# EasyEDA Pro project ReuseBlock_遥控器1.0_2026-08-15.epro

# Schematic 遥控器1.0
Board Name: 简易版; Create Date: 2025-06-16; Page Name: P1; Project Name: 遥控器; Schematic Name: Schematic1; Update Date: 2025-09-30; Company: 逸行陈Ezwalk; Page Size: A4; Version: V1.0
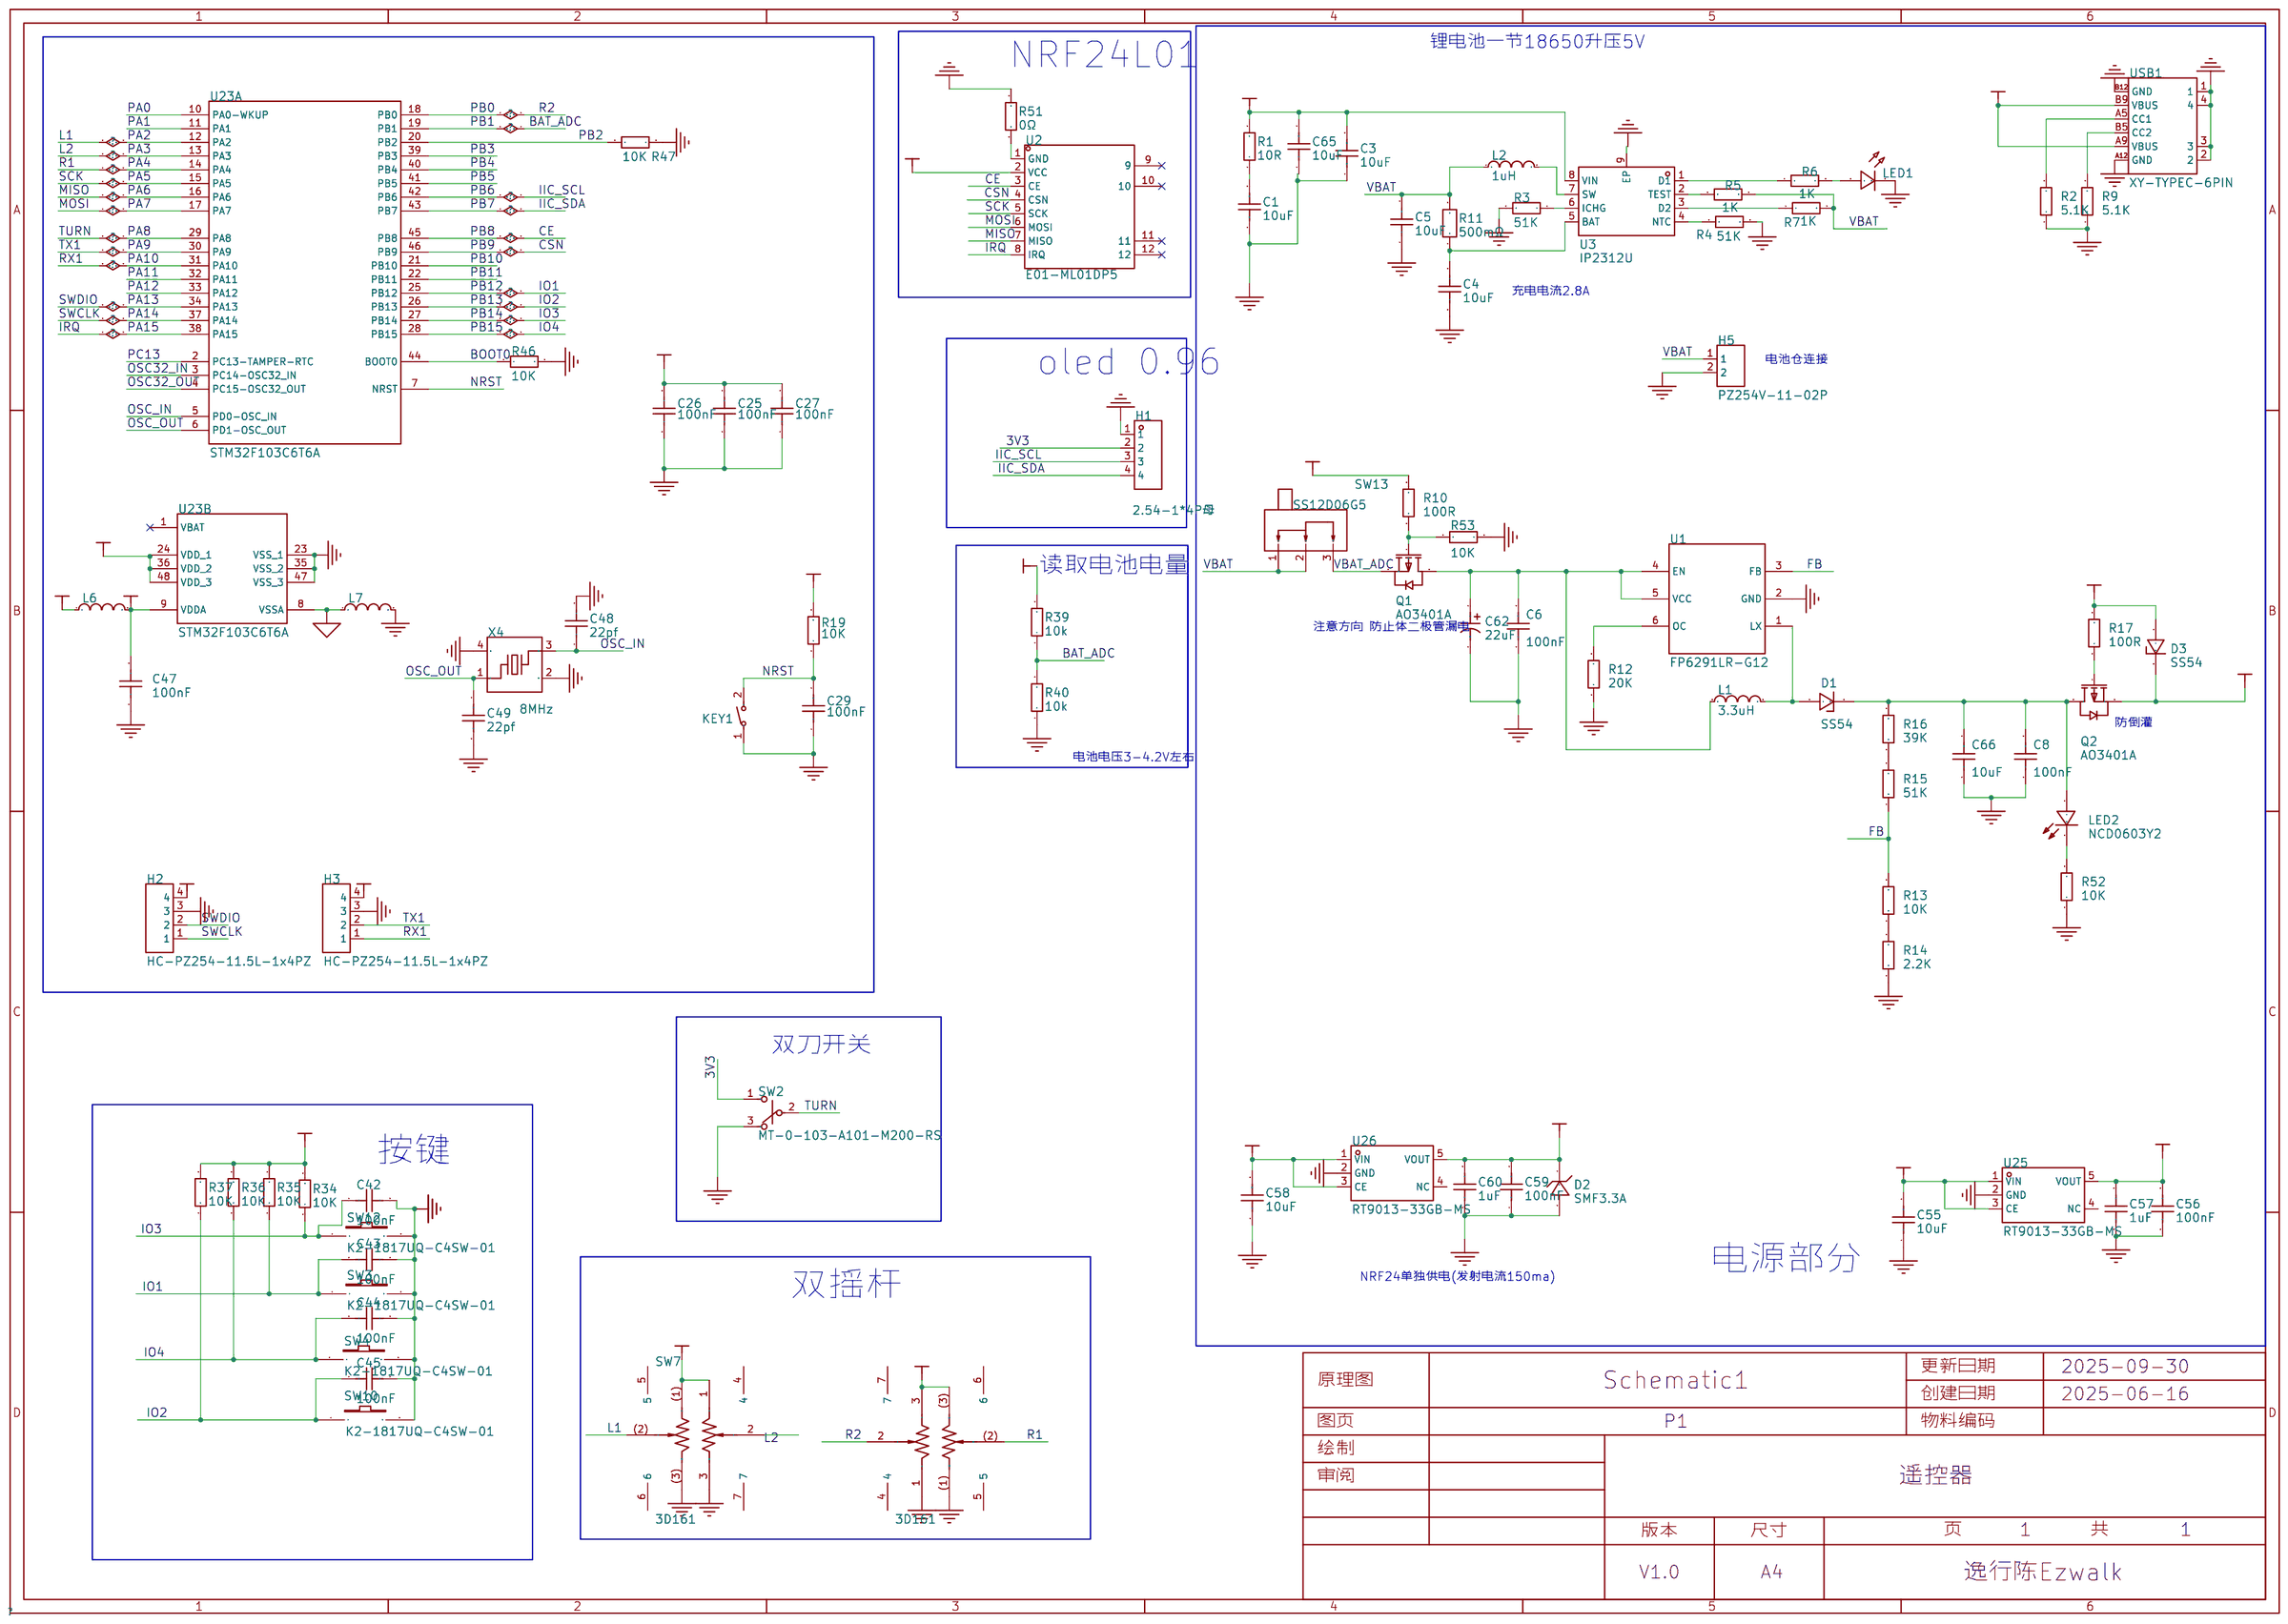
[diagram p0: schematic sheet]

## Parts
C1  10uF  [C0603]
C3  10uF  [C0603]
C4  10uF  [C0603]
C5  10uF  [C0603]
C6  100nF  [C0603]
C8  100nF  [C0603]
C25  100nF  [C0603]
C26  100nF  [C0603]
C27  100nF  [C0603]
C29  100nF  [C0603]
C42  100nF  [C0603]
C43  100nF  [C0603]
C44  100nF  [C0603]
C45  100nF  [C0603]
C47  100nF  [C0603]
C48  22pf  [C0603]
C49  22pf  [C0603]
C55  10uF  [C0603]
C56  100nF  [C0603]
C57  1uF  [C0603]
C58  10uF  [C0603]
C59  100nF  [C0603]
C60  1uF  [C0603]
C62  22uF  [CAP-SMD_BD5.0-L5.3-W5.3-LS6.3-FD-1]
C65  10uF  [C0603]
C66  10uF  [C0603]
D1  SS54  [SMA_L4.3-W2.6-LS5.0-FD]
D2  SMF3.3A  [SOD-123_L2.8-W1.8-LS3.7-RD]
D3  SS54  [SMA_L4.3-W2.6-LS5.0-FD]
H1  2.54-1*4P母  [HDR-TH_4P-P2.54-V-F]
H2  HC-PZ254-11.5L-1x4PZ  [HDR-TH_4P-P2.54-V-M]
H3  HC-PZ254-11.5L-1x4PZ  [HDR-TH_4P-P2.54-V-M]
H5  PZ254V-11-02P  [HDR-TH_2P-P2.54-V-M]
KEY1  YTS1C0051AWG00  [SW-SMD_L6.1-W3.6-LS8.0]
L1  3.3uH  [IND-SMD_L4.4-W4.2-A]
L2  1uH  [IND-SMD_L4.4-W4.2]
L6  10uH  [L0603]
L7  10uH  [L0603]
LED1  -  [LED_0603]
LED2  NCD0603Y2  [LED0603-RD]
Q1  AO3401A  [SOT-23_L2.9-W1.3-P1.90-LS2.4-BR]
Q2  AO3401A  [SOT-23_L2.9-W1.3-P1.90-LS2.4-BR]
R1  10R  [R0603]
R2  5.1K  [R0603]
R3  51K  [R0603]
R4  51K  [R0603]
R5  1K  [R0603]
R6  1K  [R0603]
R7  1K  [R0603]
R9  5.1K  [R0603]
R10  100R  [R0603]
R11  500mΩ  [R0805]
R12  20K  [R0603]
R13  10K  [R0603]
R14  2.2K  [R0603]
R15  51K  [R0603]
R16  39K  [R0603]
R17  100R  [R0603]
R19  10K  [R0603]
R34  10K  [R0603]
R35  10K  [R0603]
R36  10K  [R0603]
R37  10K  [R0603]
R39  10k  [R0603]
R40  10k  [R0603]
R46  10K  [R0603]
R47  10K  [R0603]
R51  0Ω  [R0805]
R52  10K  [R0603]
R53  10K  [R0603]
SW2  MT-0-103-A101-M200-RS  [SW-TH_MT-0-103-A101-M200-RS]
SW3  K2-1817UQ-C4SW-01  [KEY-SMD_2P-L6.0-W6.0-P6.00]
SW4  K2-1817UQ-C4SW-01  [KEY-SMD_2P-L6.0-W6.0-P6.00]
SW6  3D161  [SW-TH_3D161]
SW7  3D161  [SW-TH_3D161]
SW10  K2-1817UQ-C4SW-01  [KEY-SMD_2P-L6.0-W6.0-P6.00]
SW12  K2-1817UQ-C4SW-01  [KEY-SMD_2P-L6.0-W6.0-P6.00]
SW13  SS12D06G5  [SW-TH_SS12D06G5]
U1  FP6291LR-G12  [SOT-23-6_L2.9-W1.6-P0.95-LS2.8-BR]
U2  E01-ML01DP5  [WIRELM-TH_E01-ML01DP5]
U3  IP2312U  [ESOP-8_L4.9-W3.9-P1.27-LS6.0-BL-EP]
U23  STM32F103C6T6A  [LQFP-48_L7.0-W7.0-P0.50-LS9.0-BL]  (sections 1,2)
U25  RT9013-33GB-MS  [SOT-23-5_L2.9-W1.6-P0.95-LS2.8-BR]
U26  RT9013-33GB-MS  [SOT-23-5_L2.9-W1.6-P0.95-LS2.8-BR]
USB1  XY-TYPEC-6PIN  [USB-C-SMD_XY-TYPEC-6PIN]
X4  8MHz  [CRYSTAL-SMD_4P-L3.2-W2.5-BL-1]

## Library data of the parts
C1 C3-C6 C8 C25-C27 C29 C42-C45 C47-C49 C55-C60 C65 C66 = CAP_0603: Supplier Footprint: 0603
C62 = RVT25V22M5X5: 容值:22uF;精度:±20%;额定电压:25V;纹波电流:26mA@120Hz;; LCSC Part Name: 22uF ±20% 25V; Supplier Part: C47023110; Manufacturer: JIERR(捷而瑞); Supplier Footprint: SMD,D5xL5.4mm; JLCPCB Part Class: Extended Part; Datasheet: https://item.szlcsc.com/datasheet/RVT25V22M5X5/49206211.html; Supplier: LCSC; Tolerance: ±20%; Voltage Rating: 25V; Ripple Current: 26mA@120Hz; Diameter: 5mm; Height - Seated (Max): 5.4mm; Lifetime: 2000hrs@105℃; Operating Temperature: -55℃~+105℃
D1 D3 = SS54_C7420369: 二极管配置:独立式;正向压降(Vf):550mV@5.0A;直流反向耐压(Vr):40V;整流电流:5A;; LCSC Part Name: 电压:40V 电流:5A; Supplier Part: C7420369; Manufacturer: R+O(宏嘉诚); Supplier Footprint: SMA(DO-214AC); JLCPCB Part Class: Extended Part; Datasheet: https://item.szlcsc.com/datasheet/SS54/8397191.html; Supplier: LCSC; Diode Configuration: 独立式; Forward Voltage (Vf@If): 550mV@5.0A; Reverse Voltage (Vr): 40V; Rectified Current: 5A; Reverse Leakage Current (Ir): 50uA@40V; Voltage - Forward(Vf@If): 550mV@5.0A; Voltage - DC Reverse(Vr): 40V; Current - Rectified: 5A; Operating Junction Temperature Range: -55℃~+125℃; Non-Repetitive Peak Forward Surge Current: 120A
D2 = SMF3.3A_C283866: 极性:单向;反向截止电压(Vrwm):3.3V;钳位电压:8V;峰值脉冲电流(Ipp):25A;峰值脉冲功率(Ppp):200W@10/1000us;击穿电压:5.2V;; LCSC Part Name: 单向TVS 3.3V截止 峰值浪涌电流：25A; Supplier Part: C283866; Manufacturer: DOWO(东沃); Supplier Footprint: SOD-123FL; JLCPCB Part Class: 扩展库; Datasheet: https://item.szlcsc.com/datasheet/SMF3.3A/269417.html; Supplier: LCSC; Polarity: 单向; Reverse Stand-Off Voltage (Vrwm): 3.3V; Clamping Voltage: 8V; Peak Pulse Current (Ipp): 25A; Peak Pulse Power Dissipation (Ppp): 200W@10/1000us; Voltage - Breakdown: 5.2V; Reverse Leakage Current (Ir): 500uA; level of protection: IEC 61000-4-2；IEC 61000-4-4; Type: TVS
H1 = 2.54-1*4P母: 插孔结构:1x4P;间距:2.54mm;行距:-;圆孔/方孔:方孔;安装类型:直插;排数:单排;总孔位数:4P;额定电流:3A;额定电压:-;插孔方向:顶部;塑高:-;触头材质:青铜;触头镀层:-;工作温度范围:-40℃~+105℃;焊接温度(最大值):-;; LCSC Part Name: 间距:2.54mm 1x4P 直插; Supplier Part: C2718488; Manufacturer: BOOMELE(博穆精密); Supplier Footprint: 插件,P=2.54mm; JLCPCB Part Class: 扩展库; Datasheet: https://atta.szlcsc.com/upload/public/pdf/source/20210301/C2718488_F4427B881E42CAA8DDB0B1C12B3A522C.pdf; Supplier: LCSC; Holes Structure: 1x4P; Pitch: 2.54mm; Circular Hole / Square Hole: 方孔; Mounting Type: 直插; Number of Rows: 单排; Number of Holes: 4P; Current Rating (Max): 3A; Holes Direction: 顶部; Contact Material: 青铜; Operating Temperature Range: -40℃~+105℃
H2 H3 = HC-PZ254-11.5L-1x4PZ: 插针结构:1x4P;间距:2.54mm;行距:-;圆针/方针:方针;安装方式:直插;排数:单排;总PIN位数:4P;额定电流:3A;额定电压:-;配合针长度:6mm;塑高:2.5mm;端接针长度:3mm;触头材质:黄铜;触头镀层:金;工作温度:-40℃~+105℃;颜色:黑色;; LCSC Part Name: 1x4P 间距:2.54mm 方针 直插; Supplier Part: C27985189; Manufacturer: HC(虹成电子); Supplier Footprint: 插件,P=2.54mm; JLCPCB Part Class: 扩展库; Datasheet: https://item.szlcsc.com/datasheet/HC-PZ254-11.5L-1x4PZ/29721147.html; Supplier: LCSC; Pin Structure: 1x4P; Pitch: 2.54mm; Circluar Pins/Square Pins: 方针; Mounting Type: 直插; Number of Rows: 单排; Number of Pins: 4P; Current Rating: 3A; Length of Mating Pin: 6mm; Insulation Height: 2.5mm; Length of End Connection Pin: 3mm; Contact Material: 黄铜; Contact Plating: 金; Operating Temperature: -40℃~+105℃; Color: 黑色
H5 = PZ254V-11-02P: 插针结构:1x2P;间距:2.54mm;行距:-;圆针/方针:方针;安装方式:直插;排数:单排;总PIN位数:2P;额定电流:-;额定电压:-;配合针长度:6mm;塑高:2.5mm;端接针长度:3mm;触头材质:黄铜;触头镀层:-;工作温度:-40℃~+105℃;颜色:黑色;; LCSC Part Name: 1x2P 间距:2.54mm 方针 直插; Supplier Part: C492401; Manufacturer: XFCN(兴飞); Supplier Footprint: 插件,P=2.54mm; JLCPCB Part Class: Extended Part; Datasheet: https://item.szlcsc.com/datasheet/PZ254V-11-02P/502957.html; Supplier: LCSC; Pin Structure: 1x2P; Pitch: 2.54mm; Circluar Pins/Square Pins: 方针; Mounting Type: 直插; Number of Rows: 单排; Number of Pins: 2P; Length of Mating Pin: 6mm; Insulation Height: 2.5mm; Length of End Connection Pin: 3mm; Contact Material: 黄铜; Operating Temperature: -40℃~+105℃; Color: 黑色
KEY1 = YTS1C0051AWG00: 开关长度:6.1mm;开关宽度:3.6mm;开关高度:2.5mm;机械寿命:-;; LCSC Part Name: 白色按键头3.6x6.1x2.5 180gf两脚贴片; Supplier Part: C5159017; Manufacturer: YIYUAN(怡远); Supplier Footprint: SMD; JLCPCB Part Class: 扩展库; Datasheet: https://atta.szlcsc.com/upload/public/pdf/source/20220909/90D1F3506E0247DF6BB595157A95988A.pdf; Supplier: LCSC; Switch Length: 6.1mm; Switch Width: 3.6mm; Switch Height: 2.5mm
L1 = FXL0420-3R3-M: 电感值:3.3uH;精度:±20%;额定电流:3.3A;饱和电流(Isat):4A;类型:一体成型电感;; LCSC Part Name: 3.3uH ±20% 4A; Supplier Part: C167207; Manufacturer: cjiang(长江微电); Supplier Footprint: SMD,4.4x4.2mm; JLCPCB Part Class: Extended Part; Datasheet: https://item.szlcsc.com/datasheet/FXL0420-3R3-M/178590.html; Supplier: LCSC; Tolerance: ±20%; Current Rating: 3.3A; Current - Saturation(Isat): 4A; DC Resistance(DCR): 87mΩ; Type: 一体成型电感
L2 = FXL0420-1R0-M: 电感值:1uH;精度:±20%;额定电流:6A;饱和电流(Isat):7A;类型:一体成型电感;; LCSC Part Name: 1uH ±20% 7A; Supplier Part: C167203; Manufacturer: cjiang(长江微电); Supplier Footprint: SMD,4.2x4.4mm; JLCPCB Part Class: Extended Part; Datasheet: https://atta.szlcsc.com/upload/public/pdf/source/20240426/3189EA8206330E2108542F9E34E540E7.pdf; Supplier: LCSC; Tolerance: ±20%; Rated Current: 6A; Saturation Current (Isat): 7A; DC Resistance (DCR): 27mΩ; Type: 一体成型电感
L6 L7 = L_0603
LED1 = LED_0603-R: Supplier Footprint: 0603
LED2 = NCD0603Y2: 发光颜色:黄色;正向电压(VF):1.6V~2.6V;功率:65mW;正向电流:20mA;主波长:586nm~595nm;透镜颜色:无色透明透镜;发光强度:100mcd~220mcd;发光角度:130°;工作温度:-30℃~+85℃;; Supplier Part: C89811; Manufacturer: 国星光电; Supplier Footprint: 0603; JLCPCB Part Class: Extended Part; Datasheet: https://atta.szlcsc.com/upload/public/pdf/source/20200820/C89811_7FE84B429B6BCA3E113B125EE1452576.pdf; Supplier: LCSC; Emitted Color: 黄色; Forward Voltage (VF): 1.6V~2.6V; Power Dissipation: 65mW; Forward Current: 20mA; Dominant Wavelength: 586nm~595nm; Lens Color: 无色透明透镜; Luminous Intensity: 100mcd~220mcd; Viewing Angle: 130°; Operating Temperature: -30℃~+85℃
Q1 Q2 = AO3401A_C347476: 数量:1个P沟道;漏源电压(Vdss):30V;连续漏极电流(Id):4.2A;导通电阻(RDS(on)):50mΩ@10V;耗散功率(Pd):1.4W;阈值电压(Vgs(th)):1.3V@250uA;; LCSC Part Name: 1个P沟道 耐压:30V 电流:4.2A; Supplier Part: C347476; Manufacturer: UMW(友台半导体); Supplier Footprint: SOT-23; JLCPCB Part Class: Extended Part; Datasheet: https://item.szlcsc.com/datasheet/AO3401A/324136.html; Supplier: LCSC; Type: P沟道; Drain Source Voltage (Vdss): 30V; Continuous Drain Current (Id): 4.2A; Drain Source On Resistance (RDS(on)@Vgs,Id): 50mΩ@10V; Power Dissipation (Pd): 1.4W; Gate Threshold Voltage (Vgs(th)@Id): 400mV@250uA; Total Gate Charge (Qg@Vgs): 9.4nC@4.5V; Input Capacitance (Ciss@Vds): 954pF; Reverse Transfer Capacitance (Crss@Vds): 77pF; Operating Temperature: -55℃~+150℃; Number: 1个P沟道; Drain to Source Voltage: 30V; Current - Continuous Drain(Id): 4.2A; RDS(on): 50mΩ@10V; Pd - Power Dissipation: 1.4W; Gate Threshold Voltage (Vgs(th)): 1.3V@250uA; Gate Charge(Qg): 9.4nC@4.5V; Input Capacitance(Ciss): 954pF; Output Capacitance(Coss): 115pF
R1-R7 R9 R10 R12-R17 R19 R34-R37 R39 R40 R46 R47 R52 R53 = Res_0603: Supplier Footprint: 0603
R11 = FRL0805JR500TS: 电阻类型:厚膜电阻;阻值:500mΩ;精度:±5%;功率:125mW;最大工作电压:300V;温度系数:±300ppm/℃;; LCSC Part Name: 500mΩ ±5% 125mW 厚膜电阻; Supplier Part: C2934281; Manufacturer: FOJAN(富捷); Supplier Footprint: 0805; JLCPCB Part Class: 扩展库; Datasheet: https://atta.szlcsc.com/upload/public/pdf/source/20211221/925EC7D7225764EE0046F22065062C87.pdf; Supplier: LCSC; Type: 厚膜电阻; Tolerance: ±5%; Power(Watts): 125mW; Overload Voltage (Max): 300V; Temperature Coefficient: ±300ppm/℃; Operating Temperature Range: -55℃~+155℃
R51 = 0805W8F0000T5E: 电阻类型:厚膜电阻;阻值:0Ω;精度:±1%;功率:125mW;工作电压:150V;温度系数:±800ppm/℃;; LCSC Part Name: 0Ω ±1% 125mW 厚膜电阻; Supplier Part: C17477; Manufacturer: UNI-ROYAL(厚声); Supplier Footprint: 0805; JLCPCB Part Class: 基础库; Datasheet: https://item.szlcsc.com/datasheet/0805W8F0000T5E/18165.html; Supplier: LCSC; Type: 厚膜电阻; Tolerance: ±1%; Power(Watts): 125mW; Voltage-Supply(Max): 150V; Temperature Coefficient: ±800ppm/℃; Operating Temperature: -55℃~+155℃
SW2 = MT-0-103-A101-M200-RS: 电路结构:单刀双掷;机械寿命:-;额定电流:5A;额定电压(AC):125V;安装方式:直插;; LCSC Part Name: 小型钮子三脚三档 五件套 含配件; Supplier Part: C1788493; Manufacturer: YUEN FUNG(源丰); Supplier Footprint: 插件; JLCPCB Part Class: 扩展库; Datasheet: https://atta.szlcsc.com/upload/public/pdf/source/20230720/A7297B66510B798CA716A50870BE0E5B.pdf; Supplier: LCSC; Circuit: 单刀双掷; Switch Length: 13mm; Switch Width: 8mm; Switch Height: 28.6mm; Contact Current: 5A; Voltage Rating (AC): 125V; Actuator Type: 圆柱钮柄; Pin Style: 焊片; Mounting Style: 直插; Operating Temperature: -25℃~+85℃
SW3 SW4 SW10 SW12 = K2-1817UQ-C4SW-01: 电路结构:单刀单掷;按钮形状:圆形按钮;作用力:250gf;安装方式:立贴;开关长度:6mm;开关宽度:6mm;开关高度:5mm;触点电流:50mA;额定电压(DC):12V;绝缘电阻:100MΩ;带灯:-;机械寿命:10万次;; LCSC Part Name: 无声开关 6.0mm*6.0mm*5mm  250G; Supplier Part: C128939; Manufacturer: 韩国韩荣; Supplier Footprint: SMD; JLCPCB Part Class: 扩展库; Datasheet: https://atta.szlcsc.com/upload/public/pdf/source/20210322/C2690010_58F7DD7E136B4BFA712F0D44F3FEADD9.pdf; Supplier: LCSC; Circuit: 单刀单掷; Actuator Style: 圆形按钮; Operating Force: 250gf; Mounting Style: 立贴; Switch Length: 6mm; Switch Width: 6mm; Switch Height: 5mm; Contact Current: 50mA; Voltage Rating (DC): 12V; Insulation Resistance: 100MΩ; Mechanical Life: 10万次; Operating Temperature: -25℃~+85℃
SW6 SW7 = 3D161: 摇杆  多向; LCSC Part Name: 3D161  3D摇杆 自恢复; Supplier Part: C92593; Manufacturer: 韩国韩荣; Supplier Footprint: 插件,16x16mm; JLCPCB Part Class: 扩展库; Datasheet: https://atta.szlcsc.com/upload/public/pdf/source/20170523/1495534045704.pdf; Supplier: LCSC
SW13 = SS12D06G5: Supplier Part: C48601057; Manufacturer: HanElectricity(瀚源); Supplier Footprint: 插件; JLCPCB Part Class: 扩展库; Datasheet: https://atta.szlcsc.com/upload/public/pdf/source/20250425/687B2D98DC9F713C6587956713E4AC0B.pdf; Supplier: LCSC
U1 = FP6291LR-G12: 功能类型:升压型;工作电压:2.6V~5.5V;输出电压:600mV~12V;输出电流:-;输出类型:可调;; LCSC Part Name: 1MHz 2A 升压电流模式PWM转换器; Supplier Part: C18701; Manufacturer: Advanced Analog Technology(类比); Supplier Footprint: SOT-23-6; JLCPCB Part Class: Extended Part; Datasheet: https://item.szlcsc.com/datasheet/FP6291LR-G12/19404.html; Supplier: LCSC; Function: 升压型; Voltage - Supply: 2.6V~5.5V; Output Voltage: 600mV~12V; Frequency - Switching: 1MHz; Operating Temperature: -40℃~+85℃; Number of Outputs: 1; Topology: 升压式; Quiescent Current: 190uA; Switch tube (built-in/external): 内置; Output Type: 可调
U2 = E01-ML01DP5: NRF24L01+PA大功率模块/2.4G频段/100mW; Supplier Part: C97339; Manufacturer: EBYTE(亿佰特); Supplier Footprint: 插件; JLCPCB Part Class: Extended Part; Datasheet: https://atta.szlcsc.com/upload/public/pdf/source/20170306/1488794685960.pdf; Supplier: LCSC
U3 = IP2312U: LCSC Part Name: 降压开关充电 停产 默认充满电压4.2V; Supplier Part: C2687800; Manufacturer: INJOINIC(英集芯); Supplier Footprint: SOP-8L; JLCPCB Part Class: 扩展库; Datasheet: https://atta.szlcsc.com/upload/public/pdf/source/20200908/C605432_A60BD6D88F2FAE4109BDCDD377258269.pdf; Supplier: LCSC
U23 = STM32F103C6T6A: CPU内核:ARM-M3;CPU最大主频:72MHz;应用领域:-;; LCSC Part Name: 主流增强型ARM Cortex-M3 MCU，具有32 KB Flash、72 MHz CPU、电机控制、USB和CAN; Supplier Part: C8303; Manufacturer: ST(意法半导体); Supplier Footprint: LQFP-48(7x7); JLCPCB Part Class: 扩展库; Datasheet: https://item.szlcsc.com/datasheet/STM32F103C6T6A/8795.html; Supplier: LCSC; CPU Core: ARM-M3; CPU Maximum Speed: 72MHz; Program Storage Size: 32KB; Program Memory Type: FLASH; Number of I/O: 37; ADC (Bit): 12bit; Voltage - Supply: 2V~3.6V
U25 U26 = RT9013-33GB-MS: 输出类型:固定;最大输入电压:5.5V;输出电压:3.3V;最大输出电流:500mA;电源纹波抑制比(PSRR):75dB@(1kHz);输出极性:正极;; Supplier Part: C7434207; Manufacturer: MSKSEMI(美森科); Supplier Footprint: SOT-23-5; JLCPCB Part Class: 扩展库; Datasheet: https://atta.szlcsc.com/upload/public/pdf/source/20230705/1D6536D82D93AC1E044F3DAE104751D9.pdf; Supplier: LCSC; Output Type: 固定; Maximum Input Voltage: 5.5V; Output Voltage: 3.3V; MAX Output Current: 500mA; Power Supply Rejection Ratio (PSRR): 75dB@(1kHz); Output Polarity: 正极
USB1 = XY-TYPEC-6PIN: Type-C 母 卧贴; LCSC Part Name: Type-C 母 卧贴; Supplier Part: C53133489; Manufacturer: XYECONN(辛译); Supplier Footprint: SMD; JLCPCB Part Class: Extended Part; Datasheet: https://item.szlcsc.com/datasheet/XY-TYPEC-6PIN/56122232.html; Supplier: LCSC
X4 = XL2EL89COI-111YLC-8M: 晶振类型:贴片晶振;频率:8MHz;常温频差:±10ppm;负载电容:12pF;频率稳定度:±20ppm;; LCSC Part Name: YSX321SL 8MHZ 4P 3225 12PF ±10PPM -40~85℃ (±20PPM); Supplier Part: C2973805; Manufacturer: YXC(扬兴晶振); Supplier Footprint: SMD3225-4P; JLCPCB Part Class: 扩展库; Datasheet: https://item.szlcsc.com/datasheet/XL2EL89COI-111YLC-8M/3371202.html; Supplier: LCSC; Type: 贴片晶振; Normal temperature Frequency Tolerance: ±10ppm; Load Capacitance: 12pF; Frequency Stability: ±20ppm; Equivalent Series Resistance(ESR): 150Ω; Operating Temperature: -40℃~+85℃

## Nets
3V3: C25.2 C26.2 C27.2 C56.2 C57.2 H1.2 H2.4 H3.4 L6.1 R19.2 R34.2 R35.2 R36.2 R37.2 SW2.1 U23.24(VDD_1) U23.36(VDD_2) U23.48(VDD_3) U25.5(VOUT)
+5V: C3.2 C65.2 D3.1(A) R1.2 R10.2 R17.2 U3.8(VIN) USB1.A9(VBUS) USB1.B9(VBUS)
AGND: L7.1 U23.8(VSSA)
GND: C1.1 C3.1 C4.1 C5.1 C6.1 C8.1 C25.1 C26.1 C27.1 C29.1 C42.2 C43.2 C44.2 C45.2 C47.1 C48.2 C49.2 C55.1 C56.1 C57.1 C58.1 C59.1 C60.1 C62.2 C65.1 C66.1 D2.2 H1.1 H2.3 H3.3 H5.2 KEY1.1 L7.2 LED1.1(C) R2.1 R3.2 R4.2 R9.1 R12.1 R14.1 R40.1 R46.2 R47.2 R51.2 R52.1 R53.1 SW2.3 SW3.2 SW4.2 SW6.1 SW6.(1) SW7.3 SW7.(3) SW10.2 SW12.2 U1.2(GND) U3.9(EP) U23.23(VSS_1) U23.35(VSS_2) U23.47(VSS_3) U25.2(GND) U26.2(GND) USB1.1 USB1.2 USB1.3 USB1.4 USB1.A12(GND) USB1.B12(GND) X4.2(GND) X4.4(GND)
VBAT: C5.2 H5.1 L2.1 R5.2 R7.2 R11.2 SW13.1 SW13.2
VBAT_ADC: Q1.2(S) R39.2 SW13.3
VDDA: C47.2 L6.2 SW6.3 SW6.(3) SW7.1 SW7.(1) U23.9(VDDA)
BAT_ADC: R39.1 R40.2 U23.19(PB1)
BOOT0: R46.1 U23.44(BOOT0)
CE: U2.3(CE) U23.45(PB8)
CSN: U2.4(CSN) U23.46(PB9)
FB: R13.2 R15.1 U1.3(FB)
IIC_SCL: H1.3 U23.42(PB6)
IIC_SDA: H1.4 U23.43(PB7)
IO1: C43.1 R35.1 SW3.1 U23.25(PB12)
IO2: C45.1 R37.1 SW10.1 U23.26(PB13)
IO3: C42.1 R34.1 SW12.1 U23.27(PB14)
IO4: C44.1 R36.1 SW4.1 U23.28(PB15)
IRQ: U2.8(IRQ) U23.38(PA15)
L1: SW7.(2) U23.12(PA2)
L2: SW7.2 U23.13(PA3)
MISO: U2.7(MISO) U23.16(PA6)
MOSI: U2.6(MOSI) U23.17(PA7)
NRF24_3V3: C59.2 C60.2 D2.1 U2.2(VCC) U26.5(VOUT)
NRST: C29.2 KEY1.2 R19.1 U23.7(NRST)
OSC32_IN: U23.3(PC14-OSC32_IN)
OSC32_OUT: U23.4(PC15-OSC32_OUT)
OSC_IN: C48.1 U23.5(PD0-OSC_IN) X4.3
OSC_OUT: C49.1 U23.6(PD1-OSC_OUT) X4.1
PA0: U23.10(PA0-WKUP)
PA1: U23.11(PA1)
PA4: SW6.(2) U23.14(PA4)
PA5: U2.5(SCK) U23.15(PA5)
PA8: SW2.2 U23.29(PA8)
PA9: H3.2 U23.30(PA9)
PA10: H3.1 U23.31(PA10)
PA11: U23.32(PA11)
PA12: U23.33(PA12)
PA13: H2.2 U23.34(PA13)
PA14: H2.1 U23.37(PA14)
PB0: SW6.2 U23.18(PB0)
PB2: R47.1 U23.20(PB2)
PB3: U23.39(PB3)
PB4: U23.40(PB4)
PB5: U23.41(PB5)
PB10: U23.21(PB10)
PB11: U23.22(PB11)
PC13: U23.2(PC13-TAMPER-RTC)
VOUT: C55.2 C58.2 D3.2(K) Q2.2(S) U25.1(VIN) U25.3(CE) U26.1(VIN) U26.3(CE)
$1N22378: R51.1 U2.1(GND)
$1N26818: R2.2 USB1.A5(CC1)
$1N26819: R9.2 USB1.B5(CC2)
$1N26826: R7.1 U3.3(D2)
$1N26828: LED1.2(A) R6.2
$1N26829: R6.1 U3.1(D1)
$1N26830: R5.1 U3.2(TEST)
$1N26832: R4.1 U3.4(NTC)
$1N26833: R3.1 U3.6(ICHG)
$1N26834: C4.2 R11.1 U3.5(BAT)
$1N26836: L2.2 U3.7(SW)
$1N26838: C1.2 R1.1
$1N26842: Q1.1(G) R10.1 R53.2
$1N26844: D1.1(A) L1.2 U1.1(LX)
$1N26847: C6.2 C62.1 L1.1 Q1.3(D) U1.4(EN) U1.5(VCC)
$1N26849: R12.2 U1.6(OC)
$1N26853: LED2.1(K) R52.2
$1N26856: Q2.1(G) R17.1
$1N26861: C8.2 C66.2 D1.2(K) LED2.2(A) Q2.3(D) R16.2
$1N26862: R13.1 R14.2
$1N26863: R15.2 R16.1

Not connected (* = marked no-connect by the designer): SW6 4 5 6 7; SW7 4 5 6 7; U2 9* 10* 11* 12*; U23 1(VBAT)*; U25 4(NC); U26 4(NC)

## Notes on the sheet
- 锂电池一节18650升压5V
- NRF24L01
- 充电电流2.8A
- 电池仓连接
- oled 0.96
- 读取电池电量
- 注意方向 防止体二极管漏电
- 防倒灌
- 电池电压3-4.2V左右
- 双刀开关
- 按键
- 电源部分
- NRF24单独供电(发射电流150ma)
- 双摇杆

# Board 遥控器1.0
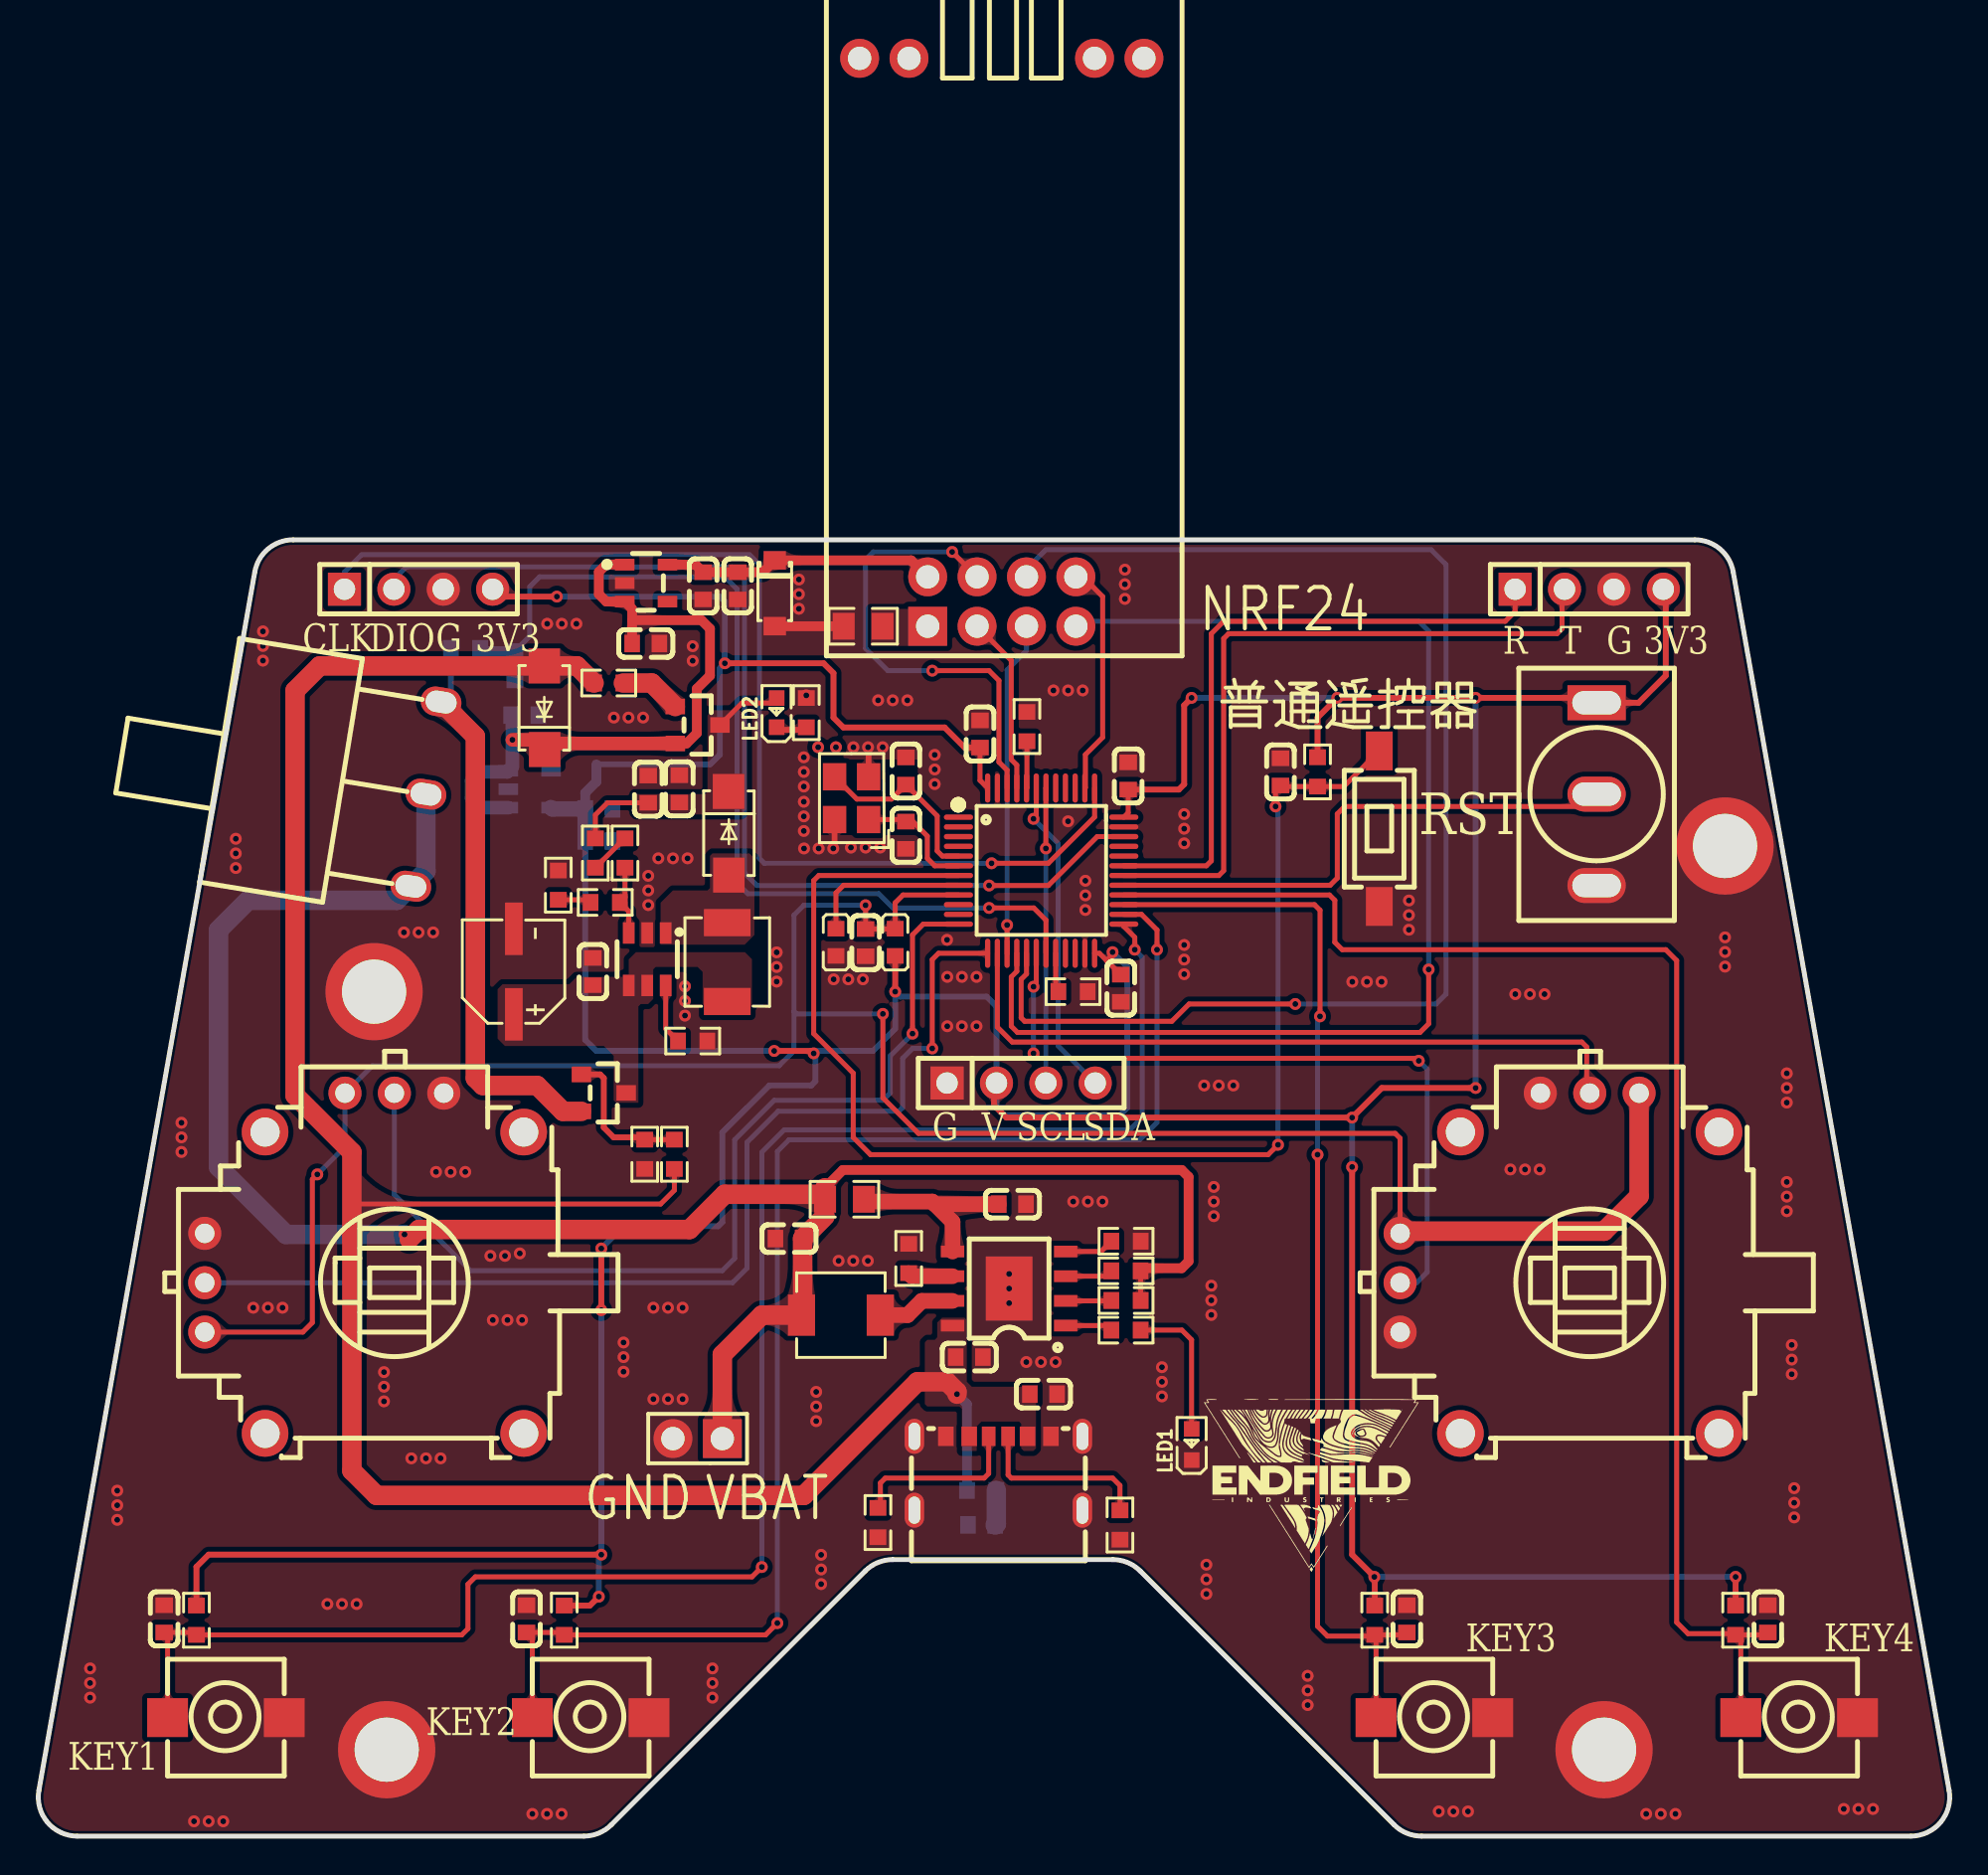
[diagram p1: board, top side]
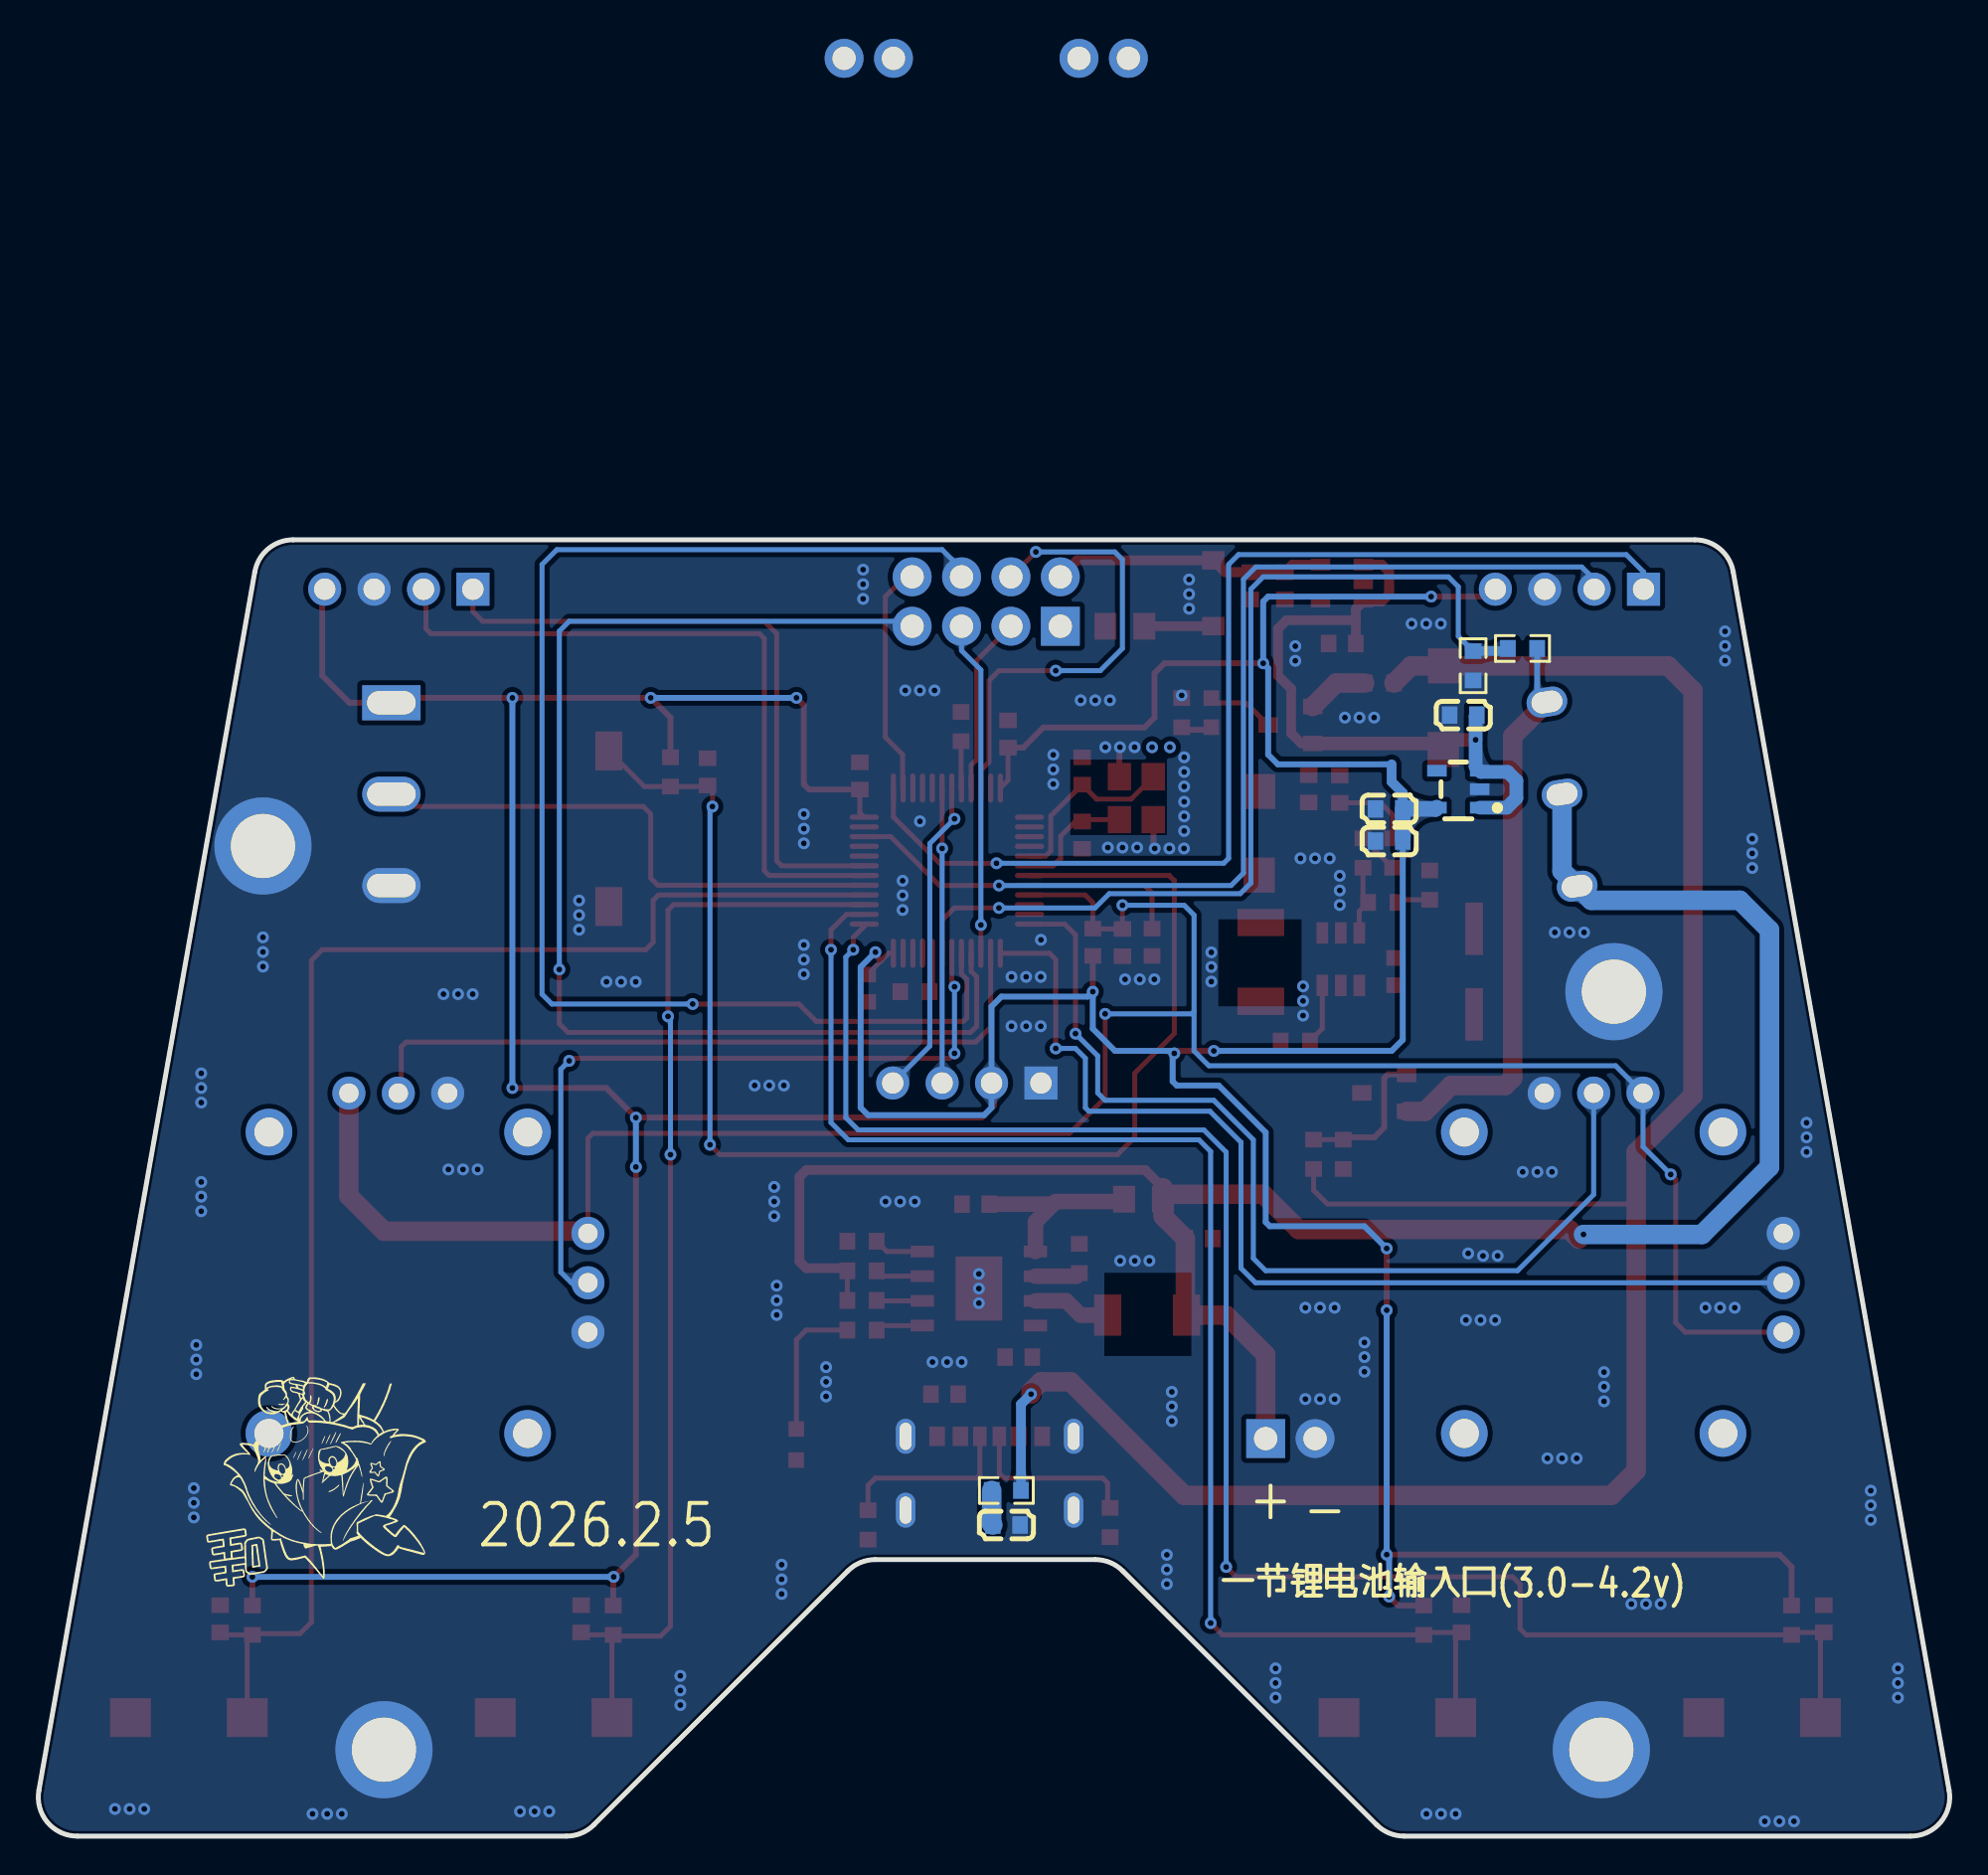
[diagram p2: board, bottom side, seen from below]

Outline 98.23 x 66.67 mm; copper layers: Top Layer, Bottom Layer. Coordinates in mm from the lower left corner of the outline.
Outline path: 0,2.35 11.1,65.02 arc(11.79,66.21) 13.07,66.67 85.16,66.67 arc(86.44,66.21) 87.13,65.02 98.23,2.35 arc(97.79,0.71) 96.26,0 71.1,0 arc(70.33,0.15) 69.69,0.59 56.63,13.64 arc(55.98,14.07) 55.22,14.22 43.91,14.22 arc(43.14,14.07) 42.49,13.64 29.44,0.59 arc(28.79,0.15) 28.03,0 1.97,0 arc(0.44,0.72) 0,2.35
Stack: Top Layer 0.035mm / Dielectric1 1.51mm FR4 er 4.5 / Bottom Layer 0.035mm

## Design rules (mm)
spacing copperThickness1oz (default): track to track 0.102, other pairs 0.152 to 0.3
spacing copperThickness2oz: track to track 0.203, other pairs 0.152 to 0.3
spacing Plane_innerPlane: track to track 0.102, other pairs 0.152 to 0.3
spacing Copper_copperRegion: track to track 0.102, other pairs 0.152 to 0.3
track width copperThickness1oz (default): min 0.127, default 0.254, max 2.54
track width copperThickness2oz: min 0.203, default 0.254, max 2.54
differential pair differentialPair (default): width min 0.127, default 0.254, max 2.54; gap min 0.152, default 0.152
net VBAT uses copperRegion

## Placement (name value [footprint] x y rotation side)
C1  10uF  [C0603]  48.48 16 0 bottom
C3  10uF  [C0603]  47.84 24.64 180 top
C4  10uF  [C0603]  50.06 32.5 180 top
C5  10uF  [C0603]  38.57 30.73 0 top
C6  100nF  [C0603]  28.49 44.47 270 top
C8  100nF  [C0603]  32.93 53.87 270 top
C25  100nF  [C0603]  55.63 43.61 90 top
C26  100nF  [C0603]  56.01 54.53 270 top
C27  100nF  [C0603]  48.39 56.69 270 top
C29  100nF  [C0603]  63.85 54.74 270 top
C42  100nF  [C0603]  70.34 11.18 90 top
C43  100nF  [C0603]  6.44 11.18 90 top
C44  100nF  [C0603]  88.91 11.18 90 top
C45  100nF  [C0603]  25.07 11.18 90 top
C47  100nF  [C0603]  42.51 45.96 90 top
C48  22pf  [C0603]  44.58 54.78 90 top
C49  22pf  [C0603]  44.58 51.48 270 top
C55  10uF  [C0603]  24.98 57.66 180 bottom
C56  100nF  [C0603]  28.79 51.18 180 bottom
C57  1uF  [C0603]  28.79 52.83 180 bottom
C58  10uF  [C0603]  31.21 61.34 180 top
C59  100nF  [C0603]  35.94 64.31 90 top
C60  1uF  [C0603]  34.16 64.31 90 top
C62  22uF  [CAP-SMD_BD5.0-L5.3-W5.3-LS6.3-FD-1]  24.42 44.47 90 top
C65  10uF  [C0603]  51.66 22.73 180 top
C66  10uF  [C0603]  31.33 53.85 270 top
D1  SS54  [SMA_L4.3-W2.6-LS5.0-FD]  35.47 51.58 90 top
D2  SMF3.3A  [SOD-123_L2.8-W1.8-LS3.7-RD]  37.84 63.93 270 top
D3  SS54  [SMA_L4.3-W2.6-LS5.0-FD]  26 58.04 270 top
H1  2.54-1*4P母  [HDR-TH_4P-P2.54-V-F]  50.51 38.73 0 top
H2  HC-PZ254-11.5L-1x4PZ  [HDR-TH_4P-P2.54-V-M]  19.52 64.14 0 top
H3  HC-PZ254-11.5L-1x4PZ  [HDR-TH_4P-P2.54-V-M]  79.72 64.14 0 top
H5  PZ254V-11-02P  [HDR-TH_2P-P2.54-V-M]  33.87 20.45 180 top
KEY1  YTS1C0051AWG00  [SW-SMD_L6.1-W3.6-LS8.0]  68.93 51.82 90 top
L1  3.3uH  [IND-SMD_L4.4-W4.2-A]  35.4 44.96 270 top
L2  1uH  [IND-SMD_L4.4-W4.2]  41.24 26.8 180 top
L6  10uH  [L0603]  44.03 45.97 90 top
L7  10uH  [L0603]  40.99 45.97 270 top
LED1  -  [LED_0603]  59.27 20.19 90 top
LED2  NCD0603Y2  [LED0603-RD]  37.94 57.78 90 top
NOREF  -  [Pad_e1204]  86.71 50.93 0 top
NOREF#2  -  [Pad_e1203]  17.24 43.43 0 top
NOREF#3  -  [Pad_e1202]  80.48 4.44 0 top
NOREF#4  -  [Pad_e1201]  17.88 4.44 0 top
Q1  AO3401A  [SOT-23_L2.9-W1.3-P1.90-LS2.4-BR]  29.05 38.23 180 top
Q2  AO3401A  [SOT-23_L2.9-W1.3-P1.90-LS2.4-BR]  33.87 57.15 180 top
R1  10R  [R0603]  48.48 17.78 180 bottom
R2  5.1K  [R0603]  43.15 16.13 90 top
R3  51K  [R0603]  44.73 29.71 90 top
R4  51K  [R0603]  55.9 30.6 0 top
R5  1K  [R0603]  55.9 27.55 0 top
R6  1K  [R0603]  55.9 26.03 0 top
R7  1K  [R0603]  55.9 29.07 0 top
R9  5.1K  [R0603]  55.59 16 90 top
R10  100R  [R0603]  32.68 35.07 270 top
R11  500mΩ  [R0805]  41.42 32.76 180 top
R12  20K  [R0603]  33.62 40.89 180 top
R13  10K  [R0603]  29.12 48.02 0 top
R14  2.2K  [R0603]  26.71 48.91 270 top
R15  51K  [R0603]  30.14 50.56 90 top
R16  39K  [R0603]  28.61 50.56 90 top
R17  100R  [R0603]  29.3 59.31 180 top
R19  10K  [R0603]  65.75 54.74 90 top
R34  10K  [R0603]  68.69 11.1 90 top
R35  10K  [R0603]  8.1 11.1 90 top
R36  10K  [R0603]  87.25 11.1 90 top
R37  10K  [R0603]  27.02 11.1 90 top
R39  10k  [R0603]  21.94 61.09 180 bottom
R40  10k  [R0603]  24.48 60.2 90 bottom
R46  10K  [R0603]  50.81 57.07 90 top
R47  10K  [R0603]  53.18 43.43 0 top
R51  0Ω  [R0805]  42.38 62.23 180 top
R52  10K  [R0603]  39.46 57.78 270 top
R53  10K  [R0603]  31.15 35.07 90 top
SW2  MT-0-103-A101-M200-RS  [SW-TH_MT-0-103-A101-M200-RS]  80.1 53.59 270 top
SW3  K2-1817UQ-C4SW-01  [KEY-SMD_2P-L6.0-W6.0-P6.00]  9.62 6.1 0 top
SW4  K2-1817UQ-C4SW-01  [KEY-SMD_2P-L6.0-W6.0-P6.00]  90.52 6.1 0 top
SW6  3D161  [SW-TH_3D161]  78.2 29.46 180 top
SW7  3D161  [SW-TH_3D161]  16.73 29.46 180 top
SW10  K2-1817UQ-C4SW-01  [KEY-SMD_2P-L6.0-W6.0-P6.00]  28.37 6.1 0 top
SW12  K2-1817UQ-C4SW-01  [KEY-SMD_2P-L6.0-W6.0-P6.00]  71.76 6.1 0 top
SW13  SS12D06G5  [SW-TH_SS12D06G5]  19.9 53.59 80.7 top
U1  FP6291LR-G12  [SOT-23-6_L2.9-W1.6-P0.95-LS2.8-BR]  31.28 45.1 90 top
U2  E01-ML01DP5  [WIRELM-TH_E01-ML01DP5]  49.51 76.84 270 top
U3  IP2312U  [ESOP-8_L4.9-W3.9-P1.27-LS6.0-BL-EP]  49.89 28.16 90 top
U23  STM32F103C6T6A  [LQFP-48_L7.0-W7.0-P0.50-LS9.0-BL]  51.54 49.66 270 top
U25  RT9013-33GB-MS  [SOT-23-5_L2.9-W1.6-P0.95-LS2.8-BR]  25.24 53.85 180 bottom
U26  RT9013-33GB-MS  [SOT-23-5_L2.9-W1.6-P0.95-LS2.8-BR]  31.22 64.45 180 top
USB1  XY-TYPEC-6PIN  [USB-C-SMD_XY-TYPEC-6PIN]  49.34 18.66 0 top
X4  8MHz  [CRYSTAL-SMD_4P-L3.2-W2.5-BL-1]  41.79 53.39 90 top

## Footprints (pads in the part's own frame, mm; a bottom-side part is the same pattern mirrored in y, then rotated)
C0603
  rect 0.8x0.9 smd: 1(-0.7,0) 2(0.7,0)
CAP-SMD_BD5.0-L5.3-W5.3-LS6.3-FD-1
  rect 2.7x0.91 smd: 1(-2.2,0) 2(2.2,0)
CRYSTAL-SMD_4P-L3.2-W2.5-BL-1
  rect 1.4x1.2 smd: 1(-1.1,-0.875) 2(1.1,-0.875) 3(1.1,0.875) 4(-1.1,0.875)
ESOP-8_L4.9-W3.9-P1.27-LS6.0-BL-EP
  rect 0.6x1.2 smd: 1(-1.905,-2.909) 2(-0.635,-2.909) 3(0.635,-2.909) 4(1.905,-2.909) 5(1.905,2.909) 6(0.635,2.909) 7(-0.635,2.909) 8(-1.905,2.909)
  rect 3.3x2.4 smd: 9(0,0)
HDR-TH_2P-P2.54-V-M
  rect 2x2 hole 1.2: 1(-1.27,0)
  round 2 hole 1.2: 2(1.27,0)
HDR-TH_4P-P2.54-V-F
  rect 1.7x1.7 hole 1.1: 1(-3.81,0)
  round 1.7 hole 1.1: 2(-1.27,0) 3(1.27,0) 4(3.81,0)
HDR-TH_4P-P2.54-V-M
  rect 1.7x1.7 hole 1.1: 1(-3.81,0)
  round 1.7 hole 1.1: 2(-1.27,0) 3(1.27,0) 4(3.81,0)
IND-SMD_L4.4-W4.2
  rect 1.4x2.12 smd: 1(2.028,0) 2(-2.028,0)
IND-SMD_L4.4-W4.2-A
  rect 1.4x2.4 smd: 1(2.028,0) 2(-2.028,0)
KEY-SMD_2P-L6.0-W6.0-P6.00
  rect 2.1x2 smd: 1(-3,0) 2(3,0)
L0603
  rect 0.8x0.864 smd: 1(-0.7,0) 2(0.7,0)
LED0603-RD
  rect 0.8x0.8 smd: 1(-0.749,0) 2(0.749,0)
LED_0603
  rect 0.8x0.8 smd: 1(-0.851,-0.01) 2(0.75,-0.005)
LQFP-48_L7.0-W7.0-P0.50-LS9.0-BL
  oval 0.27x1.5 smd: 1(-2.75,-4.25) 2(-2.25,-4.25) 3(-1.75,-4.25) 4(-1.25,-4.25) 5(-0.75,-4.25) 6(-0.25,-4.25) 7(0.25,-4.25) 8(0.75,-4.25) 9(1.25,-4.25) 10(1.75,-4.25) 11(2.25,-4.25) 12(2.75,-4.25) 25(2.75,4.25) 26(2.25,4.25) 27(1.75,4.25) 28(1.25,4.25) 29(0.75,4.25) 30(0.25,4.25) 31(-0.25,4.25) 32(-0.75,4.25) 33(-1.25,4.25) 34(-1.75,4.25) 35(-2.25,4.25) 36(-2.75,4.25)
  oval 1.5x0.27 smd: 13(4.25,-2.75) 14(4.25,-2.25) 15(4.25,-1.75) 16(4.25,-1.25) 17(4.25,-0.75) 18(4.25,-0.25) 19(4.25,0.25) 20(4.25,0.75) 21(4.25,1.25) 22(4.25,1.75) 23(4.25,2.25) 24(4.25,2.75) 37(-4.25,2.75) 38(-4.25,2.25) 39(-4.25,1.75) 40(-4.25,1.25) 41(-4.25,0.75) 42(-4.25,0.25) 43(-4.25,-0.25) 44(-4.25,-0.75) 45(-4.25,-1.25) 46(-4.25,-1.75) 47(-4.25,-2.25) 48(-4.25,-2.75)
Pad_e1201
  round 5 hole 3.3: 1(0,0)
Pad_e1202
  round 5 hole 3.3: 1(0,0)
Pad_e1203
  round 5 hole 3.3: 1(0,0)
Pad_e1204
  round 5 hole 3.3: 1(0,0)
R0603
  rect 0.806x0.864 smd: 1(-0.753,0) 2(0.753,0)
R0805
  rect 1.133x1.377 smd: 1(-1,0) 2(1,0)
SMA_L4.3-W2.6-LS5.0-FD
  rect 1.8x1.62 smd: 1(-2.15,-0.009) 2(2.15,0.009)
SOD-123_L2.8-W1.8-LS3.7-RD
  rect 0.95x1.15 smd: 1(-1.692,0) 2(1.692,0)
SOT-23-5_L2.9-W1.6-P0.95-LS2.8-BR
  rect 1x0.6 smd: 1(1.1,-0.95) 2(1.1,0) 3(1.1,0.95) 4(-1.1,0.95) 5(-1.1,-0.95)
SOT-23-6_L2.9-W1.6-P0.95-LS2.8-BR
  rect 1.1x0.6 smd: 1(1.35,-0.95) 2(1.35,0) 3(1.35,0.95) 4(-1.35,0.95) 5(-1.35,0) 6(-1.35,-0.95)
SOT-23_L2.9-W1.3-P1.90-LS2.4-BR
  rect 1x0.8 smd: 1(1.15,-0.95) 2(1.15,0.95) 3(-1.15,0)
SW-SMD_L6.1-W3.6-LS8.0
  rect 2x1.38 smd: 1(-4,0) 2(4,0)
SW-TH_3D161
  round 1.7 hole 1: 1(8.2,3.541) 2(8.2,1.001) 3(8.2,-1.539) (1)(0.99,-8.751) (2)(-1.55,-8.751) (3)(-4.09,-8.751)
  round 2.4 hole 1.5: 4(5.099,8.751) 5(-8.2,8.751) 6(-8.2,-6.749) 7(5.099,-6.749)
SW-TH_MT-0-103-A101-M200-RS
  rect 1.8x3 hole 1.2x2.5: 1(-4.7,0)
  oval 1.8x3 hole 1.2x2.5: 2(0,0) 3(4.7,0)
SW-TH_SS12D06G5
  oval 1.5x2.1 hole 1.1x1.6: 1(-4.8,0) 2(0,0) 3(4.8,0)
USB-C-SMD_XY-TYPEC-6PIN
  oval 1x1.8 hole 0.6x1.4: 1(-4.32,1.9) 2(4.32,1.9) 3(4.32,-1.9) 4(-4.32,-1.9)
  rect 0.7x1 smd: A5(-0.5,1.9) B5(0.5,1.9)
  rect 0.8x1 smd: A9(1.5,1.9) A12(2.7,1.9) B9(-1.5,1.9) B12(-2.7,1.9)
WIRELM-TH_E01-ML01DP5
  rect 2x2 hole 1.2: 1(14.605,-3.81)
  round 2 hole 1.2: 2(12.065,-3.81) 3(14.605,-1.27) 4(12.065,-1.27) 5(14.605,1.27) 6(12.065,1.27) 7(14.605,3.81) 8(12.065,3.81) 9(-14.605,-7.31) 10(-14.605,-4.77) 11(-14.605,4.77) 12(-14.605,7.31)

## Nets
As in the schematic, except:
GND: C1.1 C3.1 C4.1 C5.1 C6.1 C8.1 C25.1 C26.1 C27.1 C29.1 C42.2 C43.2 C44.2 C45.2 C47.1 C48.2 C49.2 C55.1 C56.1 C57.1 C58.1 C59.1 C60.1 C62.2 C65.1 C66.1 D2.2 H1.1 H2.3 H3.3 H5.2 KEY1.1 L7.2 LED1.1 NOREF.1 NOREF#2.1 NOREF#3.1 NOREF#4.1 R2.1 R3.2 R4.2 R9.1 R12.1 R14.1 R40.1 R46.2 R47.2 R51.2 R52.1 R53.1 SW2.3 SW3.2 SW4.2 SW6.1 SW6.(1) SW7.3 SW7.(3) SW10.2 SW12.2 U1.2 U3.9 U23.23 U23.35 U23.47 U25.2 U26.2 USB1.1 USB1.2 USB1.3 USB1.4 USB1.A12 USB1.B12 X4.2 X4.4

Pads without a net: SW6 4 5 6 7; SW7 4 5 6 7; U2 9 10 11 12; U23 1; U25 4; U26 4

## Via types
v1: diameter 0.61, hole 0.305, Top Layer to Bottom Layer, 249 vias

## Routing (per net, layer and track width the routed paths; a pad name or vN(x,y) marks a point on that pad's centre or on a via; arc(x,y) is an arc through that point)
3V3: length 306.8
  Top Layer w0.254: C27.2 48.39,54.3 U23.48 ; C25.2 54.53,45.41 U23.24 ; U23.36 56.01,52.64 C26.2
  Top Layer w0.3: C27.2 47.61,55.99 46.57,57.02 41.37,57.02 40.86,57.53 40.86,59.82 40.35,60.33 v1(35.27,60.33) ; v1(44.03,43.43) L6.1 ; v1(67.53,34.42) 67.53,14.48 v1(68.67,13.33) 68.69,13.31 R34.2 ; 54.92,45.02 55.21,45.31 v1(55.21,45.47) ; v1(59.27,58.55) 58.89,58.17 58.89,54.1 58.62,53.83 C26.2 ; v1(73.88,38.48) 69.05,38.48 v1(67.53,36.96) 49.75,36.96 49.11,37.59 49.11,38.61 H1.2 ; v1(37.81,40.39) 39.72,40.39 v1(39.84,40.26) ; H3.4 83.66,64.01 83.66,59.69 82.26,58.29 SW2.1 79.85,58.55 v1(73.88,58.55) v1(66.77,58.55) 65.75,57.53 R19.2 ; R35.2 8.1,13.85 8.73,14.48 v1(28.92,14.48) ; v1(28.79,12.32) 28.33,11.86 R37.2 ; v1(28.92,27.05) v1(28.92,30.23) ; H2.4 23.71,63.75 v1(26.64,63.75) ; R36.2 v1(87.25,13.33)
  Bottom Layer w0.3: 28.67,55.13 34.52,55.13 35.02,55.63 35.02,60.07 v1(35.27,60.33) 35.27,63.5 35.02,63.75 v1(26.64,63.75) ; v1(67.53,34.42) v1(67.53,36.96) ; v1(28.79,12.32) 28.79,14.35 v1(28.92,14.48) v1(28.92,27.05) ; v1(59.27,58.55) v1(66.77,58.55) ; v1(55.21,45.47) 55.97,44.7 55.97,37.47 55.59,37.08 49.62,37.08 49.24,37.47 H1.2 49.24,42.67 48.73,43.18 44.29,43.18 v1(44.03,43.43) 44.03,41.53 42.89,40.39 39.97,40.39 v1(39.84,40.26) 39.93,40.17 39.93,38.82 39.72,38.61 37.56,38.61 35.14,36.19 35.14,31.58 34.93,31.37 30.06,31.37 v1(28.92,30.23) ; v1(37.81,40.39) 28.67,40.39 28.09,40.96 C56.2 ; v1(87.25,13.33) v1(68.67,13.33) ; v1(73.88,38.48) v1(73.88,58.55)
  Bottom Layer w0.5: C57.2 28.09,53.66 28.67,54.23 28.67,55.13
  Bottom Layer w0.8: U25.5 26.4,52.83 C57.2 C56.2
+5V: length 114.9
  Top Layer w0.254: 16.35,32.39 16.48,32.51 31.97,32.51 32.68,33.22 R10.2
  Top Layer w1: v1(47.21,22.73) 47.21,22.86 46.7,23.37 45.18,23.37 39.34,17.53 17.36,17.53 16.09,18.8 16.09,35.18 13.17,38.1 13.17,58.92 14.44,60.19 D3.1 27.67,60.19 R17.2
  Bottom Layer w0.5: R1.2 47.73,22.22 v1(47.21,22.73)
AGND: length 8.3
  Top Layer w0.254: L7.1 40.99,48.51 41.38,48.91 U23.8
GND: length 6.6
  Top Layer w0.3: X4.4 40.91,50.87 v1(40.85,50.8) ; X4.2 42.66,55.98 v1(42.64,56.01)
  Top Layer w0.5: R51.2 37.84,62.23 D2.2
  vias: v1(2.63,8.63) v1(2.63,7.87) v1(2.63,7.12) v1(4.03,17.77) v1(4.03,17.02) v1(4.03,16.27) v1(7.33,36.69) v1(7.33,35.94) v1(7.33,35.19) v1(7.98,0.76) v1(8.73,0.76) v1(9.48,0.76) v1(10.12,51.3) v1(10.12,50.55) v1(10.12,49.79) v1(11.02,27.18) v1(11.52,61.97) v1(11.52,61.21) v1(11.52,60.46) v1(11.78,27.18) v1(12.53,27.18) v1(14.83,11.94) v1(15.59,11.94) v1(16.34,11.94) v1(17.75,23.87) v1(17.75,23.11) v1(17.75,22.36) v1(18.77,46.48) v1(19.15,19.43) v1(19.52,46.48) v1(19.9,19.43) v1(20.28,46.48) v1(20.42,34.16) v1(20.66,19.43) v1(21.17,34.16) v1(21.93,34.16) v1(23.22,29.84) v1(23.34,26.54) v1(23.97,29.84) v1(24.09,26.54) v1(24.73,29.97) v1(24.85,26.54) v1(25.38,1.14) v1(26.13,1.14) v1(26.14,62.36) v1(26.89,62.36) v1(26.88,1.14) v1(27.64,62.36) v1(29.57,57.53) v1(30.06,25.39) v1(30.06,24.64) v1(30.06,23.89) v1(30.32,57.53) v1(31.07,57.53) v1(31.33,49.39) v1(31.33,48.64) v1(31.33,47.89) v1(31.6,27.18) v1(31.6,22.48) v1(31.85,50.29) v1(32.35,27.18) v1(32.35,22.48) v1(32.6,50.29) v1(33.1,27.18) v1(33.1,22.48) v1(33.22,43.71) v1(33.22,42.96) v1(33.22,42.2) v1(33.36,50.29) v1(33.62,61.2) v1(33.62,60.45) v1(34.64,8.63) v1(34.64,7.87) v1(34.64,7.12) v1(37.94,45.46) v1(37.94,44.7) v1(37.94,43.95) v1(39.08,64.63) v1(39.08,63.88) v1(39.08,63.13) v1(39.34,55.49) v1(39.34,54.74) v1(39.34,53.98) v1(39.34,53.2) v1(39.34,52.45) v1(39.34,51.7) v1(39.34,50.8) v1(39.46,58.67) v1(39.97,22.85) v1(39.97,22.1) v1(39.97,21.35) v1(40.1,50.8) v1(40.22,14.47) v1(40.22,13.72) v1(40.22,12.96) v1(40.87,44.07) v1(41.12,29.59) v1(41.62,44.07) v1(41.76,50.85) v1(41.88,56.01) v1(41.88,29.59) v1(42.37,44.07) v1(42.51,50.85) v1(42.63,29.59) v1(43.16,58.42) v1(43.26,50.85) v1(43.39,56.01) v1(43.91,58.42) v1(44.66,58.42) v1(46.07,55.62) v1(46.07,54.86) v1(46.07,54.11) v1(46.7,46.1) v1(46.71,44.2) v1(46.71,41.66) v1(47.46,44.2) v1(47.46,41.66) v1(48.22,44.2) v1(48.22,41.66) v1(49.89,28.92) v1(49.89,28.16) v1(49.89,27.41) v1(50.78,24.38) v1(51.53,24.38) v1(52.17,58.93) v1(52.28,24.38) v1(52.92,58.93) v1(52.92,52.2) v1(53.19,32.64) v1(53.68,58.93) v1(53.81,49.14) v1(53.81,48.39) v1(53.81,47.64) v1(53.94,32.64) v1(54.69,32.64) v1(55.84,65.14) v1(55.84,64.39) v1(55.84,63.64) v1(57.75,24.12) v1(57.75,23.37) v1(57.75,22.62) v1(58.89,52.57) v1(58.89,51.82) v1(58.89,51.06) v1(58.89,45.84) v1(58.89,45.08) v1(58.89,44.33) v1(59.92,38.61) v1(60.04,13.96) v1(60.04,13.21) v1(60.04,12.46) v1(60.29,28.31) v1(60.29,27.56) v1(60.29,26.81) v1(60.42,33.39) v1(60.42,32.64) v1(60.42,31.89) v1(60.67,38.61) v1(61.42,38.61) v1(65.24,8.25) v1(65.24,7.49) v1(65.24,6.74) v1(67.54,43.94) v1(68.29,43.94) v1(69.04,43.94) v1(70.45,48.12) v1(70.45,47.37) v1(70.45,46.62) v1(71.98,1.27) v1(72.74,1.27) v1(73.49,1.27) v1(75.67,34.29) v1(75.92,43.31) v1(76.42,34.29) v1(76.67,43.31) v1(77.17,34.29) v1(77.43,43.31) v1(82.65,1.14) v1(83.4,1.14) v1(84.16,1.14) v1(86.71,46.23) v1(86.71,45.48) v1(86.71,44.72) v1(89.88,39.23) v1(89.88,38.48) v1(89.88,37.73) v1(89.88,33.64) v1(89.88,32.89) v1(89.88,32.14) v1(90.13,25.26) v1(90.13,24.51) v1(90.13,23.76) v1(90.26,17.9) v1(90.26,17.14) v1(90.26,16.39) v1(92.81,1.4) v1(93.56,1.4) v1(94.32,1.4)
VBAT: length 105.6
  Top Layer w0.254: R7.2 R5.2
  Top Layer w0.5: 40.42,33.35 41.34,34.26 58.77,34.26 59.12,33.91 59.12,29.56 58.77,29.21 56.79,29.21 R7.2
  Top Layer w0.8: R11.2 40.42,31.89
  Top Layer w1: 40.42,31.89 C5.2 39.27,26.86 L2.1 37.18,26.8 35.14,24.77 H5.1 ; 19.04,30.7 19.54,31.2 33.45,31.2 35.26,33.01 40.17,33.01 R11.2 40.42,33.35
  Bottom Layer w1: SW13.2 19.9,49.64 SW13.1 18.4,48.13 10.76,48.13 9.24,46.61 9.24,34.42 12.71,30.95 v1(18.8,30.95)
VBAT_ADC: length 29.2
  Top Layer w1: SW13.3 22.44,56.57 22.44,38.99 22.83,38.61 25.62,38.61 26.95,37.28 Q1.2
  Bottom Layer w0.3: R39.2 21.18,58.83 SW13.3
VDDA: length 120.3
  Top Layer w0.254: SW6.3 70,35.89 69.74,36.14 45.23,36.14 43.4,37.97 v1(43.4,42.29) ; SW7.1 13.57,25.92 14.06,26.42 14.06,33.78 v1(14.32,34.04) ; U23.9 44.44,48.41 44.03,48.01 L6.2 44.02,46.66 C47.2 v1(42.51,47.88)
  Top Layer w1: SW6.3 70.11,31.11 80.48,31.11 82.29,32.92 SW6.(3)
  Bottom Layer w0.254: 38.83,42.42 38.96,42.29 v1(43.4,42.29) ; 38.83,42.42 38.83,47.37 39.34,47.88 v1(42.51,47.88) ; 38.83,42.42 38.83,40.39 38.06,39.62 17.15,39.62 SW7.(1) 15.74,35.46 v1(14.32,34.04)
(no net):
  vias: v1(40.07,56.01) v1(40.99,56.01)
BAT_ADC: length 49.9
  Top Layer w0.254: v1(48.86,47.74) 51.16,47.74 51.79,47.11 U23.19
  Bottom Layer w0.254: v1(48.86,47.74) 43.92,47.74 43.19,48.47 36.45,48.47 35.91,49.02 35.91,64.14 35.27,64.77 25.75,64.77 25.24,64.26 25.24,61.71 R40.2
  Bottom Layer w0.5: 22.83,60.95 R40.2
BOOT0: length 2.4
  Top Layer w0.254: U23.44 50.81,53.93 R46.1
CE: length 9.2
  Top Layer w0.254: U2.3 50,60.47 50,55.37 50.29,55.09 U23.45
CSN: length 24.2
  Top Layer w0.254: U23.46 49.79,54.83 49.37,55.25 49.37,59.44 48.86,59.94 v1(45.94,59.94) ; U2.4 v1(46.96,66.05)
  Bottom Layer w0.254: v1(46.96,66.05) 42.9,66.05 42.51,65.66 42.51,61.09 43.65,59.94 v1(45.94,59.94)
FB: length 3.7
  Top Layer w0.254: 30.14,49.81 30.14,48.29 R13.2 30.33,47.57 U1.3
IIC_SCL: length 15.2
  Top Layer w0.254: U23.42 51.78,53.9 v1(51.78,50.8)
  Bottom Layer w0.254: H1.3 v1(51.78,50.8)
IIC_SDA: length 16.5
  Top Layer w0.254: v1(51.15,52.32) 51.29,52.47 U23.43
  Bottom Layer w0.254: H1.4 52.42,40.64 52.42,51.05 v1(51.15,52.32)
IO1: length 90
  Top Layer w0.254: v1(56.35,45.59) 56.35,46.23 55.79,46.79 U23.25 ; SW3.1 6.62,10.3 C43.1 7.98,10.48 R35.1 21.75,10.35 22.06,10.67 22.06,12.95 22.44,13.33 36.67,13.33 v1(37.18,13.84)
  Bottom Layer w0.254: v1(56.35,45.59) 56.73,45.21 56.73,36.96 56.1,36.32 38.32,36.32 37.18,35.18 v1(37.18,13.84)
IO2: length 74.1
  Top Layer w0.254: U23.26 56.7,47.41 57.5,46.61 v1(57.5,45.59) ; SW10.1 25.37,10.17 C45.1 26.89,10.48 R37.1 37.37,10.35 v1(37.97,10.96)
  Bottom Layer w0.254: v1(37.97,10.96) 37.97,35.21 38.57,35.81 56.61,35.81 57.5,36.7 v1(57.5,45.59)
IO3: length 56.3
  Top Layer w0.254: v1(65.75,35.05) 65.75,10.79 66.26,10.29 68.63,10.29 R34.1 ; R34.1 68.76,10.29 SW12.1 ; R34.1 70.22,10.35 C42.1 ; v1(65.88,42.16) 65.88,47.62 65.59,47.91 U23.27
  Bottom Layer w0.254: v1(65.88,42.16) 65.75,42.04 v1(65.75,35.05)
IO4: length 74.5
  Top Layer w0.254: R36.1 87.19,10.41 84.8,10.41 84.22,11 84.22,45.03 83.66,45.59 67.02,45.59 66.64,45.97 66.64,48.13 66.36,48.41 U23.28 ; R36.1 88.78,10.35 C44.1 ; R36.1 87.52,10.09 SW4.1
IRQ: length 12
  Top Layer w0.254: U2.8 53.69,64.77 54.7,63.75 54.7,56.52 53.81,55.63 53.81,53.93 U23.38
L1: length 50.9
  Top Layer w0.254: U23.12 45.48,46.91 44.92,46.36 v1(44.92,41.28)
  Bottom Layer w0.254: v1(44.92,41.28) 43.78,40.13 43.78,38.23 43.4,37.85 37.81,37.85 35.78,35.81 35.78,29.72 35.14,29.08 22.19,29.08 18.28,32.99 SW7.(2)
L2: length 55.2
  Top Layer w0.254: U23.13 46.26,45.41 45.94,45.08 v1(45.94,40.51)
  Bottom Layer w0.254: v1(45.94,40.51) 44.92,40.51 44.41,40 44.41,37.47 44.24,37.29 38.01,37.29 36.41,35.69 36.41,29.21 35.67,28.46 SW7.2
MISO: length 64.3
  Top Layer w0.254: U23.16 50.29,44.48 50,44.2 50,41.66 50.32,41.34 71.02,41.34 71.47,41.78 v1(71.47,44.58)
  Bottom Layer w0.254: v1(71.47,44.58) 71.47,61.98 70.96,62.48 53.58,62.48 U2.7
MOSI: length 70.7
  Top Layer w0.254: U23.17 50.79,44.35 50.51,44.07 50.51,42.09 50.69,41.91 58.26,41.91 59.15,42.8 v1(64.61,42.8)
  Bottom Layer w0.254: v1(64.61,42.8) 71.85,42.8 72.35,43.31 72.35,65.41 71.59,66.17 51.78,66.17 50.78,65.17 U2.6
NRF24_3V3: length 14.1
  Top Layer w0.5: U2.2 44.85,65.62 D2.1 37.23,65.01 C59.2 C60.2 33.77,65.4 U26.5
NRST: length 68.5
  Top Layer w0.254: v1(63.59,52.96) 63.59,53.78 C29.2 63.9,53.98 R19.1 67.09,53.98 KEY1.2 ; v1(63.72,35.56) 63.21,35.05 42.76,35.05 41.88,35.94 41.88,39.24 39.84,41.28 39.84,49.15 40.1,49.41 U23.7
  Bottom Layer w0.254: v1(63.59,52.96) 63.72,52.83 v1(63.72,35.56)
OSC_IN: length 9.7
  Top Layer w0.254: U23.5 46.46,50.41 46.19,50.67 46.19,52.47 C48.1 43.84,53.34 42.06,53.34 X4.3
OSC_OUT: length 6.3
  Top Layer w0.254: U23.6 46.07,49.91 45.69,50.29 45.69,51.44 44.94,52.18 C49.1 44.48,52.29 X4.1
PA4: length 37
  Top Layer w0.254: U23.14 49.29,41.61 50.05,40.84 79.34,40.84 79.59,40.59 79.59,38.37 SW6.(2)
PA5: length 17.2
  Top Layer w0.254: U23.15 v1(49.79,46.86)
  Bottom Layer w0.254: U2.5 50.78,60.98 49.79,59.98 v1(49.79,46.86)
PA8: length 28.2
  Top Layer w0.254: SW2.2 79.47,52.96 67.15,52.96 66.77,52.58 66.77,49.28 66.4,48.91 U23.29
PA9: length 36.9
  Top Layer w0.254: U23.30 60.68,49.41 60.93,49.66 60.93,61.59 61.18,61.85 78.07,61.85 78.32,62.1 78.32,64.01 H3.2
PA10: length 33.5
  Top Layer w0.254: U23.31 60.03,49.91 60.29,50.17 60.29,61.85 60.93,62.48 75.4,62.48 75.91,62.99 H3.1
PA13: length 55
  Top Layer w0.254: U23.34 54.42,51.41 51.91,48.89 v1(48.86,48.89)
  Bottom Layer w0.254: v1(48.86,48.89) 36.92,48.89 36.29,49.53 36.29,64.64 35.65,65.28 18.89,65.28 18.25,64.64 H2.2
PA14: length 57.7
  Top Layer w0.254: v1(48.99,50.04) 51.91,50.04 54.29,52.42 U23.37
  Bottom Layer w0.254: v1(48.99,50.04) 37.3,50.04 37.05,50.29 37.05,65.41 36.54,65.91 16.6,65.91 15.71,65.02 H2.1
PB0: length 37.8
  Top Layer w0.254: U23.18 51.29,43.83 v1(51.15,43.69) ; v1(51.15,40.26) 51.4,40 70.83,40 v1(70.96,39.88)
  Bottom Layer w0.254: v1(70.96,39.88) 71.39,39.45 71.39,29.01 70.85,28.46 SW6.2 ; v1(51.15,43.69) v1(51.15,40.26)
PB2: length 2
  Top Layer w0.254: U23.20 52.29,43.43
VOUT: length 34.2
  Top Layer w0.5: 30.51,62.54 30.51,63.11 30.12,63.5 29.18,63.5 28.79,63.88 28.79,65.02 29.18,65.41 30.12,65.41 30.12,65.4 ; 30.51,62.54 30.51,61.47 ; 30.51,62.54 34.07,62.54 34.51,62.1 34.51,59.69 33.83,59.01 33.83,56.73 33.31,56.2 Q2.2
  Top Layer w0.7: Q2.2 26.32,56.2 D3.2 25.51,56.39 v1(24.35,56.39)
  Bottom Layer w0.7: C55.2 24.35,57.59 v1(24.35,56.39) 24.35,55.01 U25.3 24.08,54.74 22.7,54.74 22.25,54.29 22.25,53.39 22.75,52.9 U25.1
$1N26818: length 9
  Top Layer w0.254: R2.2 43.27,17.01 43.27,18.16 43.53,18.42 48.61,18.42 48.84,18.65 USB1.A5
$1N26819: length 9.2
  Top Layer w0.254: R9.2 55.59,18.03 55.21,18.42 50,18.42 49.84,18.58 USB1.B5
$1N26826: length 2.5
  Top Layer w0.254: U3.3 54.87,28.8 55.15,29.07
$1N26828: length 7.4
  Top Layer w0.254: R6.2 58.77,26.03 59.27,25.53 59.27,20.95 LED1.2
$1N26829: length 2.4
  Top Layer w0.254: 55.15,26.03 54.92,26.26 U3.1
$1N26830: length 2.4
  Top Layer w0.254: U3.2 55.13,27.53 55.15,27.55
$1N26832: length 2.6
  Top Layer w0.254: 55.15,30.6 54.62,30.07 U3.4
$1N26833: length 2.3
  Top Layer w0.8: R3.1 44.88,28.8 U3.6
$1N26834: length 9.9
  Top Layer w0.8: 46.07,32.5 46.98,31.59 U3.5 ; 46.07,32.5 C4.2 ; 46.07,32.5 45.94,32.64 42.54,32.64 R11.1
$1N26836: length 4
  Top Layer w0.8: U3.7 45.4,27.53 44.67,26.8 L2.2
$1N26838: length 1.8
  Bottom Layer w1: C1.2 49.23,16.06 R1.1
$1N26842: length 7.7
  Top Layer w0.254: R10.1 R53.2
  Top Layer w0.3: R53.2 31.04,35.94 29.56,35.94 29.05,36.45 29.05,38.99 28.86,39.18 Q1.1
$1N26849: length 3.1
  Top Layer w0.254: R12.2 32.23,41.53 U1.6
$1N26853: length 1.6
  Top Layer w0.3: LED2.1 38.07,56.9 39.46,56.9
$1N26856: length 3.2
  Top Layer w1: Q2.1 31.52,59.31 R17.1
$1N26861: length 7.6
  Top Layer w0.254: R16.2 28.61,52.53 29.24,53.15 C66.2 ; 37.94,58.28 36.15,58.28 Q2.3
$1N26862: length 1.7
  Top Layer w0.254: R14.2 28.23,48.16 R13.1
$1N26863: length 2.1
  Top Layer w0.254: R15.2 30.12,51.32 28.61,49.81

## Copper pours and planes (outline as drawn; the poured copper is in the pictures)
+5V on Top Layer: 45.56,26.67 51.27,26.67 51.27,19.81 45.56,19.81
GND on Top Layer: -3.46,74.04 113.12,74.04 113.12,-5.21 -3.46,-5.21
GND on Bottom Layer: -5.37,73.41 110.46,73.41 110.46,-4.32 -5.37,-4.32
$1N22378 on Top Layer: 42.77,63.12 46.7,63.12 46.7,61.21 42.77,61.21
$1N26844 on Top Layer: 31.97,50.55 36.8,50.55 36.8,45.85 31.97,45.85
$1N26847 on Top Layer: 23.59,44.2 31.59,44.2 31.59,37.72 23.59,37.72
$1N26847 on Top Layer: 30.33,45.47 36.67,45.47 36.67,42.67 30.33,42.67
$1N26861 on Top Layer: 30.62,57.91 36.41,57.91 36.41,52.55 30.62,52.55

Small or netless copper shapes (teardrops, artwork), in the pictures only: 203 on Top Layer, 75 on Bottom Layer

## Text on the board
Bottom Silkscreen Layer: - | + | 2026.2.5 | 一节锂电池输入口(3.0-4.2v)
Top Silkscreen Layer: GND | VBAT | NRF24 | KEY1 | CLK | DIO | KEY2 | G | 3V3 | V | SCL | SDA | KEY3 | R | T | KEY4 | RST | 普通遥控器
